# EAGLE schematic PDU_v2 (EAGLE 9.6.2)

## Sheet 1 of 10: PC104 Header
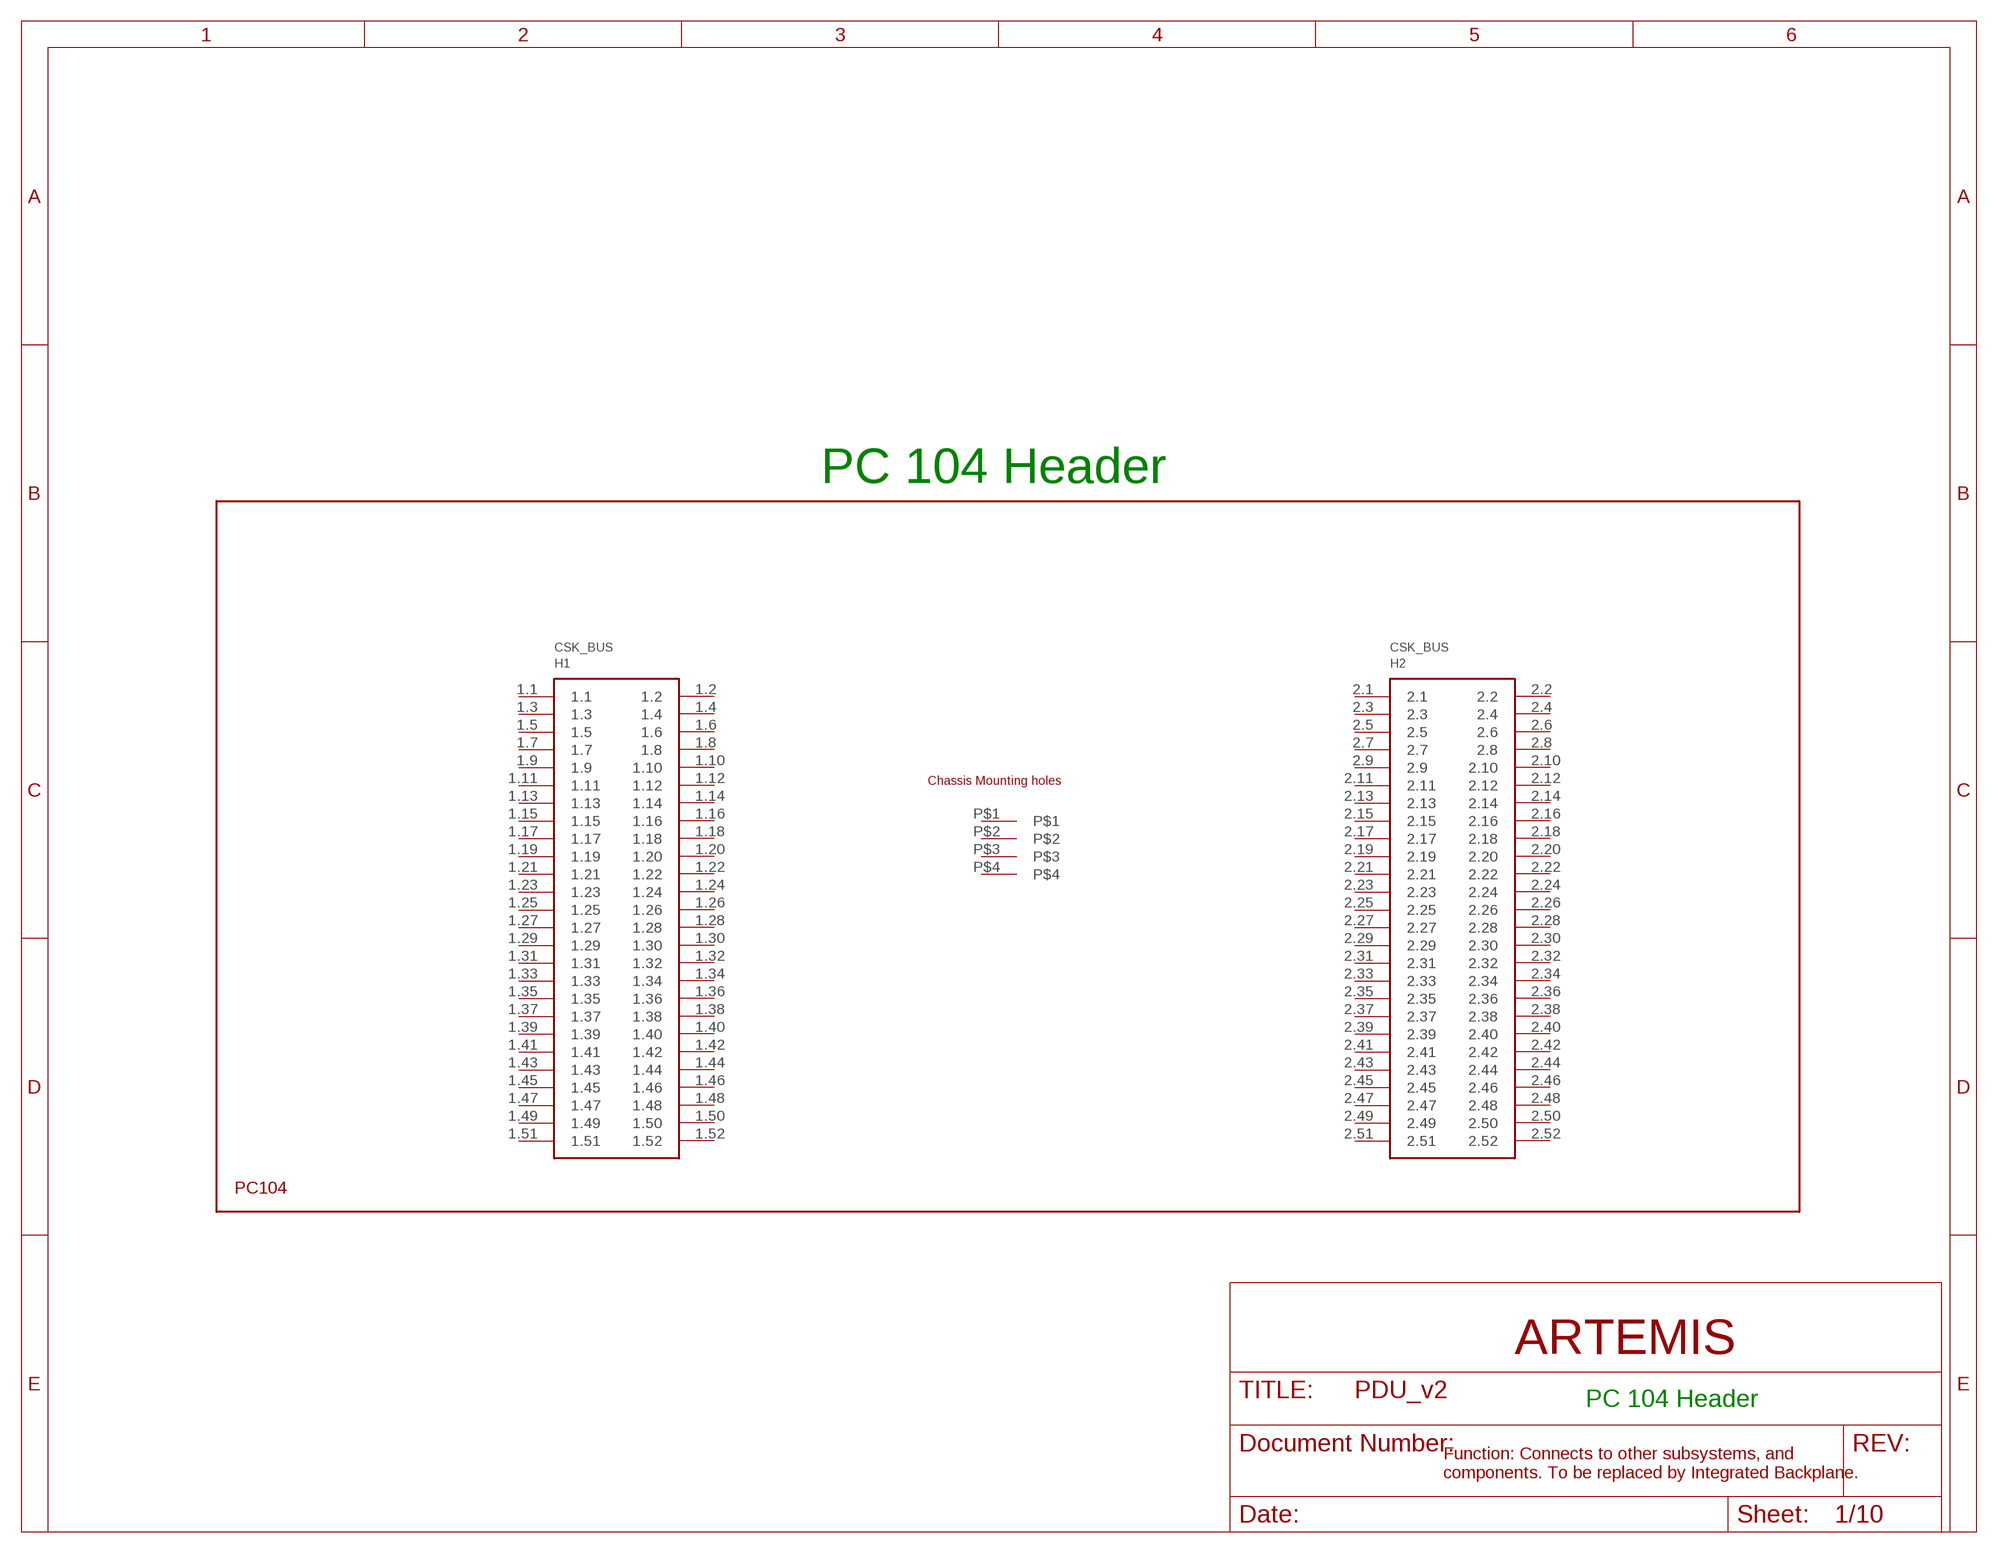
[diagram p0: schematic, sheet 1]

### Parts
H1  PC104_WCONN  [PC104_WCONN]
Unconnected: H1.1.1 H1.1.2 H1.1.3 H1.1.4 H1.1.5 H1.1.6 H1.1.7 H1.1.8 H1.1.9 H1.1.10 H1.1.11 H1.1.12 H1.1.13 H1.1.14 H1.1.15 H1.1.16 H1.1.17 H1.1.18 H1.1.19 H1.1.20 H1.1.21 H1.1.22 H1.1.23 H1.1.24 H1.1.25 H1.1.26 H1.1.27 H1.1.28 H1.1.29 H1.1.30 H1.1.31 H1.1.32 H1.1.33 H1.1.34 H1.1.35 H1.1.36 H1.1.37 H1.1.38 H1.1.39 H1.1.40 H1.1.41 H1.1.42 H1.1.43 H1.1.44 H1.1.45 H1.1.46 H1.1.47 H1.1.48 H1.1.49 H1.1.50 H1.1.51 H1.1.52 H1.2.1 H1.2.2 H1.2.3 H1.2.4 H1.2.5 H1.2.6 H1.2.7 H1.2.8 H1.2.9 H1.2.10 H1.2.11 H1.2.12 H1.2.13 H1.2.14 H1.2.15 H1.2.16 H1.2.17 H1.2.18 H1.2.19 H1.2.20 H1.2.21 H1.2.22 H1.2.23 H1.2.24 H1.2.25 H1.2.26 H1.2.27 H1.2.28 H1.2.29 H1.2.30 H1.2.31 H1.2.32 H1.2.33 H1.2.34 H1.2.35 H1.2.36 H1.2.37 H1.2.38 H1.2.39 H1.2.40 H1.2.41 H1.2.42 H1.2.43 H1.2.44 H1.2.45 H1.2.46 H1.2.47 H1.2.48 H1.2.49 H1.2.50 H1.2.51 H1.2.52 H1.P$1 H1.P$2 H1.P$3 H1.P$4

### Notes on the sheet
- PC 104 Header
- ARTEMIS
- PC 104 Header
- Function: Connects to other subsystems, and 
  components. To be replaced by Integrated Backplane.

## Sheet 2 of 10: Connectors
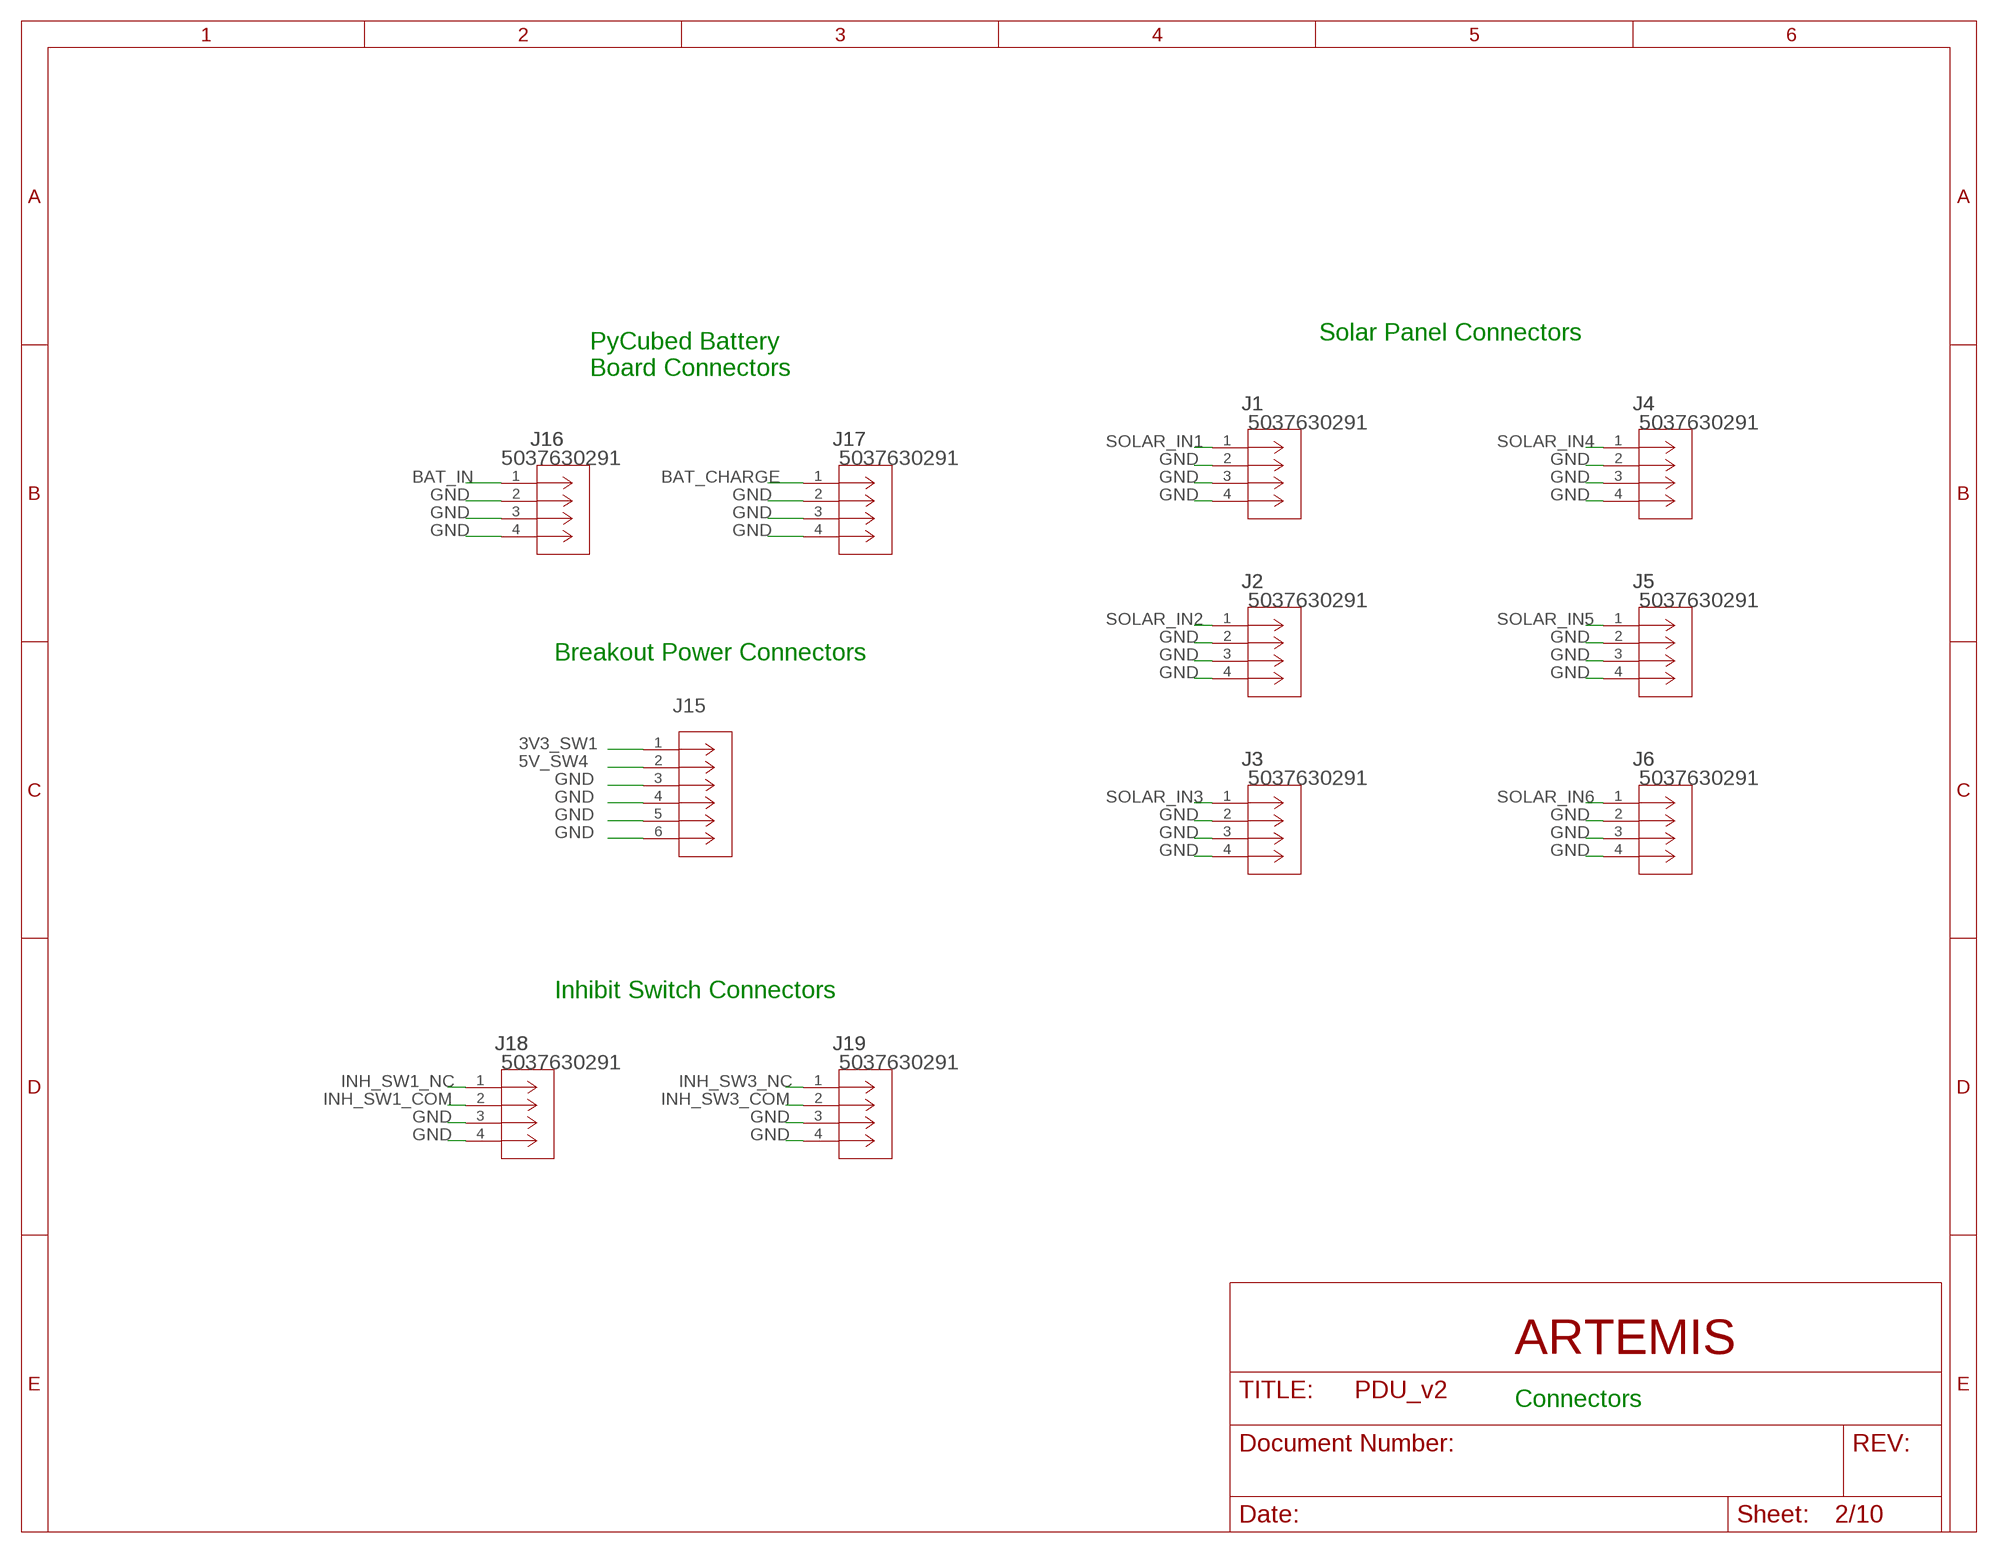
[diagram p1: schematic, sheet 2]

### Parts
J1  5037630291  [CON_5037630291]
J2  5037630291  [CON_5037630291]
J3  5037630291  [CON_5037630291]
J4  5037630291  [CON_5037630291]
J5  5037630291  [CON_5037630291]
J6  5037630291  [CON_5037630291]
J15  5037630491  [CON_5037630491]
J16  5037630291  [CON_5037630291]
J17  5037630291  [CON_5037630291]
J18  5037630291  [CON_5037630291]
J19  5037630291  [CON_5037630291]

### Nets
3V3_SW1: J15.1
5V_SW4: J15.2
BAT_CHARGE: J17.1
BAT_IN: J16.1
GND: J1.2 J1.3 J1.4 J2.2 J2.3 J2.4 J3.2 J3.3 J3.4 J4.2 J4.3 J4.4 J5.2 J5.3 J5.4 J6.2 J6.3 J6.4 J15.3 J15.4 J15.5 J15.6 J16.2 J16.3 J16.4 J17.2 J17.3 J17.4 J18.3 J18.4 J19.3 J19.4 ; also sheet 3,4,5,6,7,8,9
INH_SW1_COM: J18.2
INH_SW1_NC: J18.1
INH_SW3_COM: J19.2
INH_SW3_NC: J19.1
SOLAR_IN1: J1.1 ; also sheet 7
SOLAR_IN2: J2.1 ; also sheet 7
SOLAR_IN3: J3.1 ; also sheet 7
SOLAR_IN4: J4.1 ; also sheet 7
SOLAR_IN5: J5.1 ; also sheet 7
SOLAR_IN6: J6.1 ; also sheet 7

### Notes on the sheet
- Solar Panel Connectors
- PyCubed Battery 
  Board Connectors
- Breakout Power Connectors
- Inhibit Switch Connectors
- ARTEMIS
- Connectors

## Sheet 3 of 10: H-Bridge Circuits
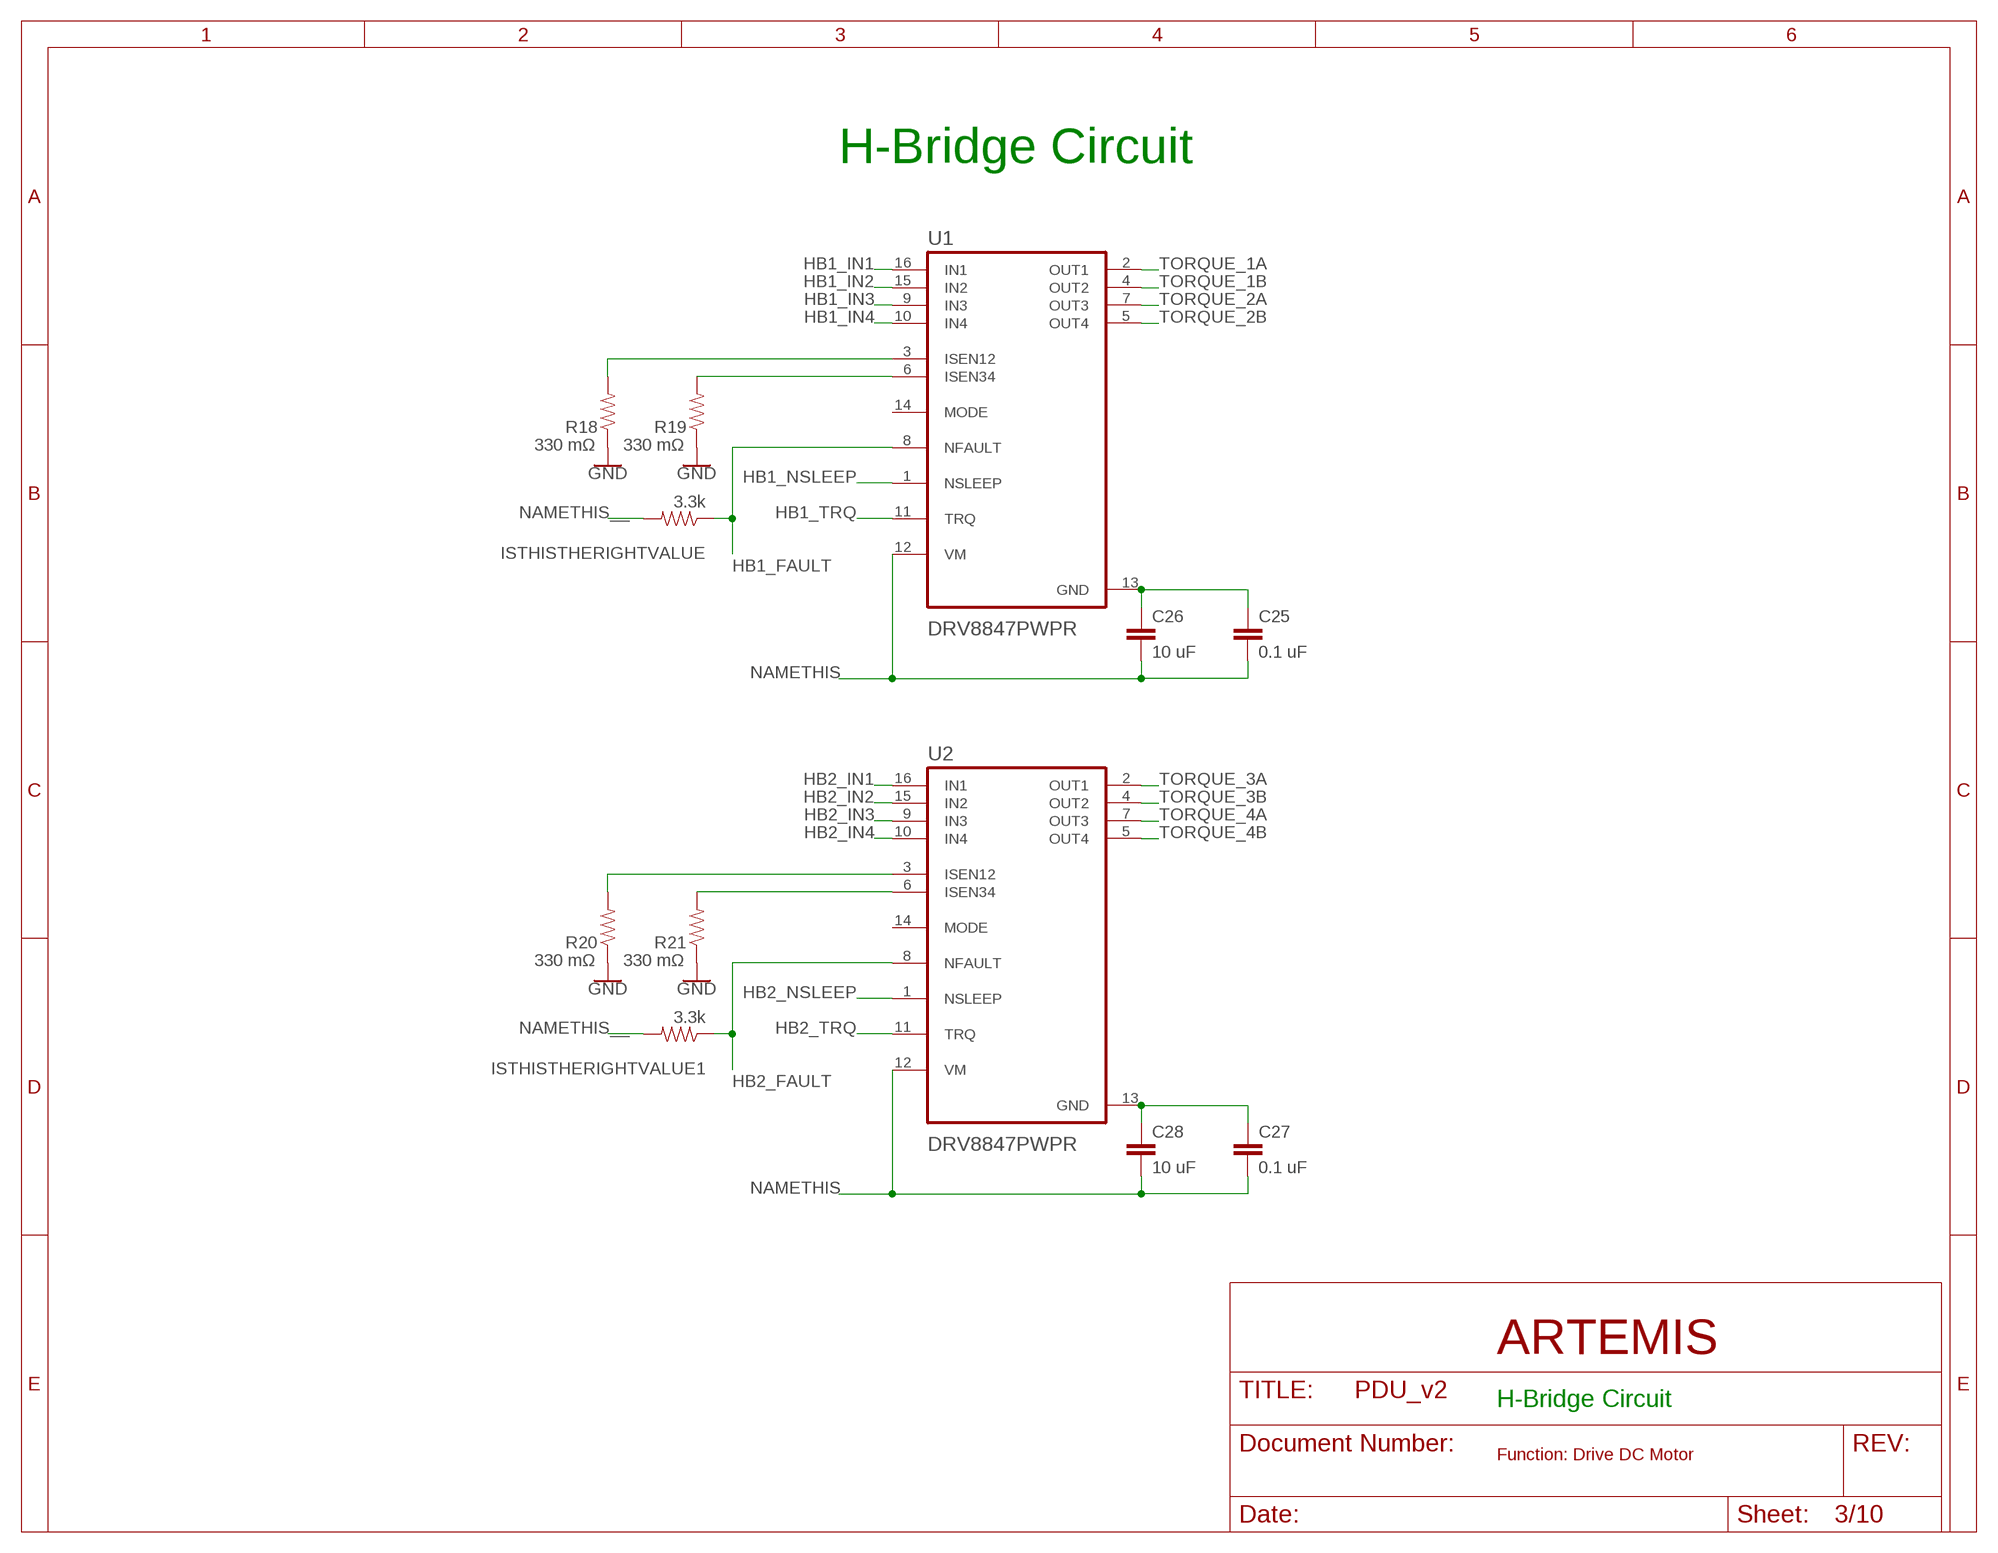
[diagram p2: schematic, sheet 3]

### Parts
C25  0.1 uF  CAP0805  [0805]
C26  10 uF  CAP0805  [0805]
C27  0.1 uF  CAP0805  [0805]
C28  10 uF  CAP0805  [0805]
ISTHISTHERIGHTVALUE  3.3k  RESISTOR0805-RES  [0805]
ISTHISTHERIGHTVALUE1  3.3k  RESISTOR0805-RES  [0805]
R18  330 mΩ  RESISTOR0805-RES  [0805]
R19  330 mΩ  RESISTOR0805-RES  [0805]
R20  330 mΩ  RESISTOR0805-RES  [0805]
R21  330 mΩ  RESISTOR0805-RES  [0805]
U1  DRV8847PWPR  [SOP65P640X120-17N]
U2  DRV8847PWPR  [SOP65P640X120-17N]

### Nets
GND: R18.1 R19.1 R20.1 R21.1 ; also sheet 2,4,5,6,7,8,9
HB1_FAULT: ISTHISTHERIGHTVALUE.1 U1.8(NFAULT)
HB1_IN1: U1.16(IN1)
HB1_IN2: U1.15(IN2)
HB1_IN3: U1.9(IN3)
HB1_IN4: U1.10(IN4)
HB1_NSLEEP: U1.1(NSLEEP)
HB1_TRQ: U1.11(TRQ)
HB2_FAULT: ISTHISTHERIGHTVALUE1.1 U2.8(NFAULT)
HB2_IN1: U2.16(IN1)
HB2_IN2: U2.15(IN2)
HB2_IN3: U2.9(IN3)
HB2_IN4: U2.10(IN4)
HB2_NSLEEP: U2.1(NSLEEP)
HB2_TRQ: U2.11(TRQ)
N$19: C27.1 C28.1 U2.13(GND)
N$20: C25.1 C26.1 U1.13(GND)
N$21: R19.2 U1.6(ISEN34)
N$22: R18.2 U1.3(ISEN12)
N$23: R21.2 U2.6(ISEN34)
N$24: R20.2 U2.3(ISEN12)
NAMETHIS: C25.2 C26.2 C27.2 C28.2 U1.12(VM) U2.12(VM)
NAMETHIS__: ISTHISTHERIGHTVALUE1.2 ISTHISTHERIGHTVALUE.2
TORQUE_1A: U1.2(OUT1)
TORQUE_1B: U1.4(OUT2)
TORQUE_2A: U1.7(OUT3)
TORQUE_2B: U1.5(OUT4)
TORQUE_3A: U2.2(OUT1)
TORQUE_3B: U2.4(OUT2)
TORQUE_4A: U2.7(OUT3)
TORQUE_4B: U2.5(OUT4)
Unconnected: U1.14(MODE) U2.14(MODE)

### Notes on the sheet
- H-Bridge Circuit
- ARTEMIS
- H-Bridge Circuit
- Function: Drive DC Motor

## Sheet 4 of 10: Switch Regulator (3V3, 5V, VBattery)
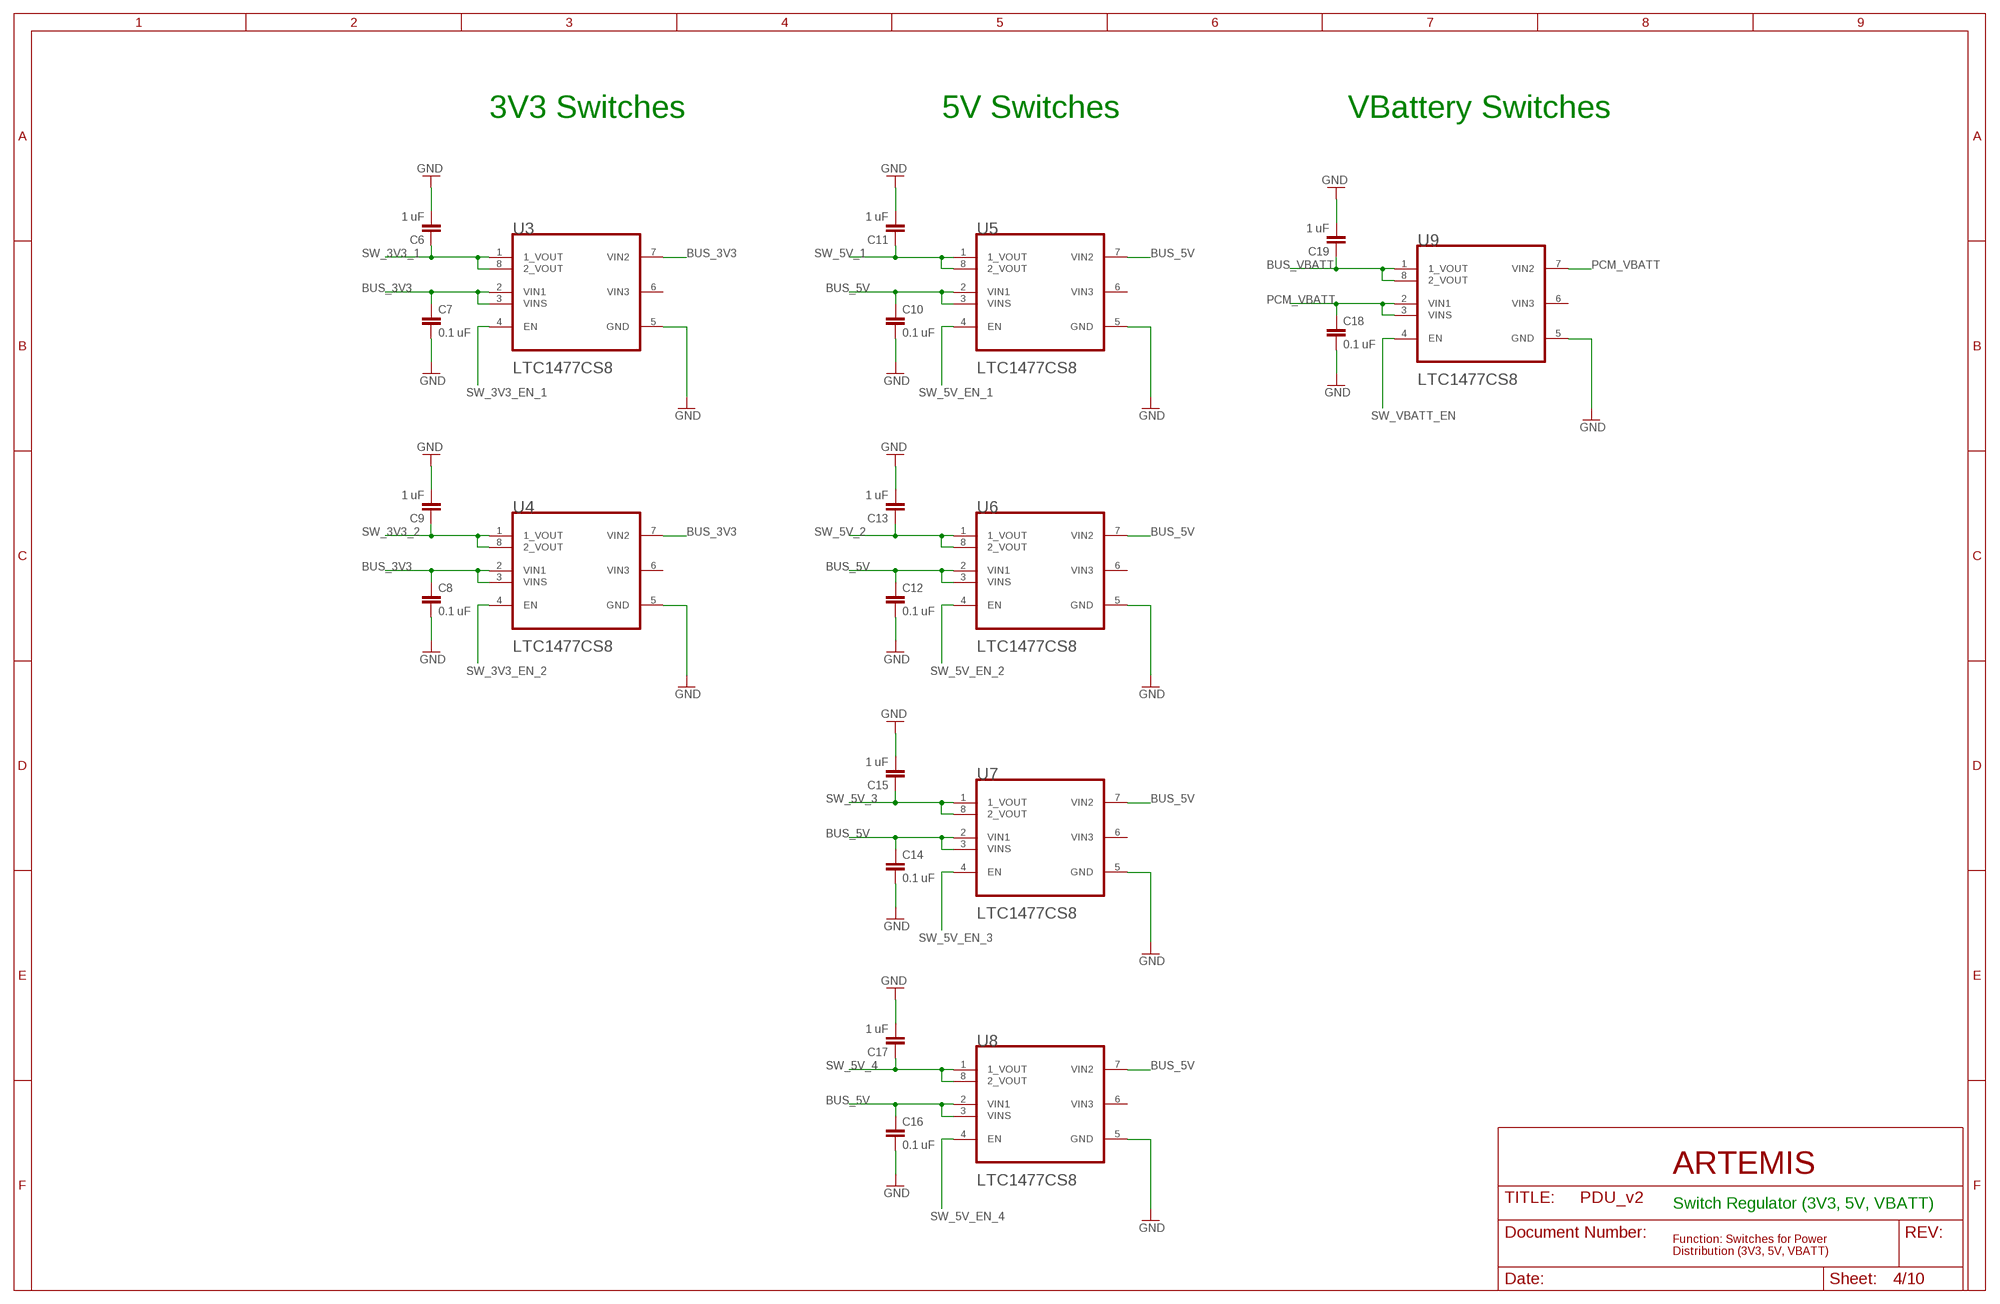
[diagram p3: schematic, sheet 4]

### Parts
C6  1 uF  CAP0805  [0805]
C7  0.1 uF  CAP0805  [0805]
C8  0.1 uF  CAP0805  [0805]
C9  1 uF  CAP0805  [0805]
C10  0.1 uF  CAP0805  [0805]
C11  1 uF  CAP0805  [0805]
C12  0.1 uF  CAP0805  [0805]
C13  1 uF  CAP0805  [0805]
C14  0.1 uF  CAP0805  [0805]
C15  1 uF  CAP0805  [0805]
C16  0.1 uF  CAP0805  [0805]
C17  1 uF  CAP0805  [0805]
C18  0.1 uF  CAP0805  [0805]
C19  1 uF  CAP0805  [0805]
U3  LTC1477CS8LINEAR_TECHNOLOGY_LTC1477CS8_0_2  [LINEAR_TECHNOLOGY_LTC1477CS8_2]
U4  LTC1477CS8LINEAR_TECHNOLOGY_LTC1477CS8_0_2  [LINEAR_TECHNOLOGY_LTC1477CS8_2]
U5  LTC1477CS8LINEAR_TECHNOLOGY_LTC1477CS8_0_2  [LINEAR_TECHNOLOGY_LTC1477CS8_2]
U6  LTC1477CS8LINEAR_TECHNOLOGY_LTC1477CS8_0_2  [LINEAR_TECHNOLOGY_LTC1477CS8_2]
U7  LTC1477CS8LINEAR_TECHNOLOGY_LTC1477CS8_0_2  [LINEAR_TECHNOLOGY_LTC1477CS8_2]
U8  LTC1477CS8LINEAR_TECHNOLOGY_LTC1477CS8_0_2  [LINEAR_TECHNOLOGY_LTC1477CS8_2]
U9  LTC1477CS8LINEAR_TECHNOLOGY_LTC1477CS8_0_2  [LINEAR_TECHNOLOGY_LTC1477CS8_2]

### Nets
BUS_3V3: C7.1 C8.1 U3.2(VIN1) U3.3(VINS) U3.7(VIN2) U4.2(VIN1) U4.3(VINS) U4.7(VIN2) ; also sheet 6
BUS_5V: C10.1 C12.1 C14.1 C16.1 U5.2(VIN1) U5.3(VINS) U5.7(VIN2) U6.2(VIN1) U6.3(VINS) U6.7(VIN2) U7.2(VIN1) U7.3(VINS) U7.7(VIN2) U8.2(VIN1) U8.3(VINS) U8.7(VIN2) ; also sheet 6
BUS_VBATT: C19.1 U9.1(1_VOUT) U9.8(2_VOUT)
GND: C6.2 C7.2 C8.2 C9.2 C10.2 C11.2 C12.2 C13.2 C14.2 C15.2 C16.2 C17.2 C18.2 C19.2 U3.5(GND) U4.5(GND) U5.5(GND) U6.5(GND) U7.5(GND) U8.5(GND) U9.5(GND) ; also sheet 2,3,5,6,7,8,9
PCM_VBATT: C18.1 U9.2(VIN1) U9.3(VINS) U9.7(VIN2) ; also sheet 6,7
SW_3V3_1: C6.1 U3.1(1_VOUT) U3.8(2_VOUT)
SW_3V3_2: C9.1 U4.1(1_VOUT) U4.8(2_VOUT)
SW_3V3_EN_1: U3.4(EN)
SW_3V3_EN_2: U4.4(EN)
SW_5V_1: C11.1 U5.1(1_VOUT) U5.8(2_VOUT)
SW_5V_2: C13.1 U6.1(1_VOUT) U6.8(2_VOUT)
SW_5V_3: C15.1 U7.1(1_VOUT) U7.8(2_VOUT)
SW_5V_4: C17.1 U8.1(1_VOUT) U8.8(2_VOUT)
SW_5V_EN_1: U5.4(EN)
SW_5V_EN_2: U6.4(EN)
SW_5V_EN_3: U7.4(EN)
SW_5V_EN_4: U8.4(EN)
SW_VBATT_EN: U9.4(EN)

### Notes on the sheet
- 3V3 Switches | 5V Switches | VBattery Switches
- ARTEMIS
- Switch Regulator (3V3, 5V, VBATT) | Switches (3V3, 5V, VBATT)
- Function: Switches for Power 
  Distribution (3V3, 5V, VBATT)

## Sheet 5 of 10: Switch Regulator (12V)
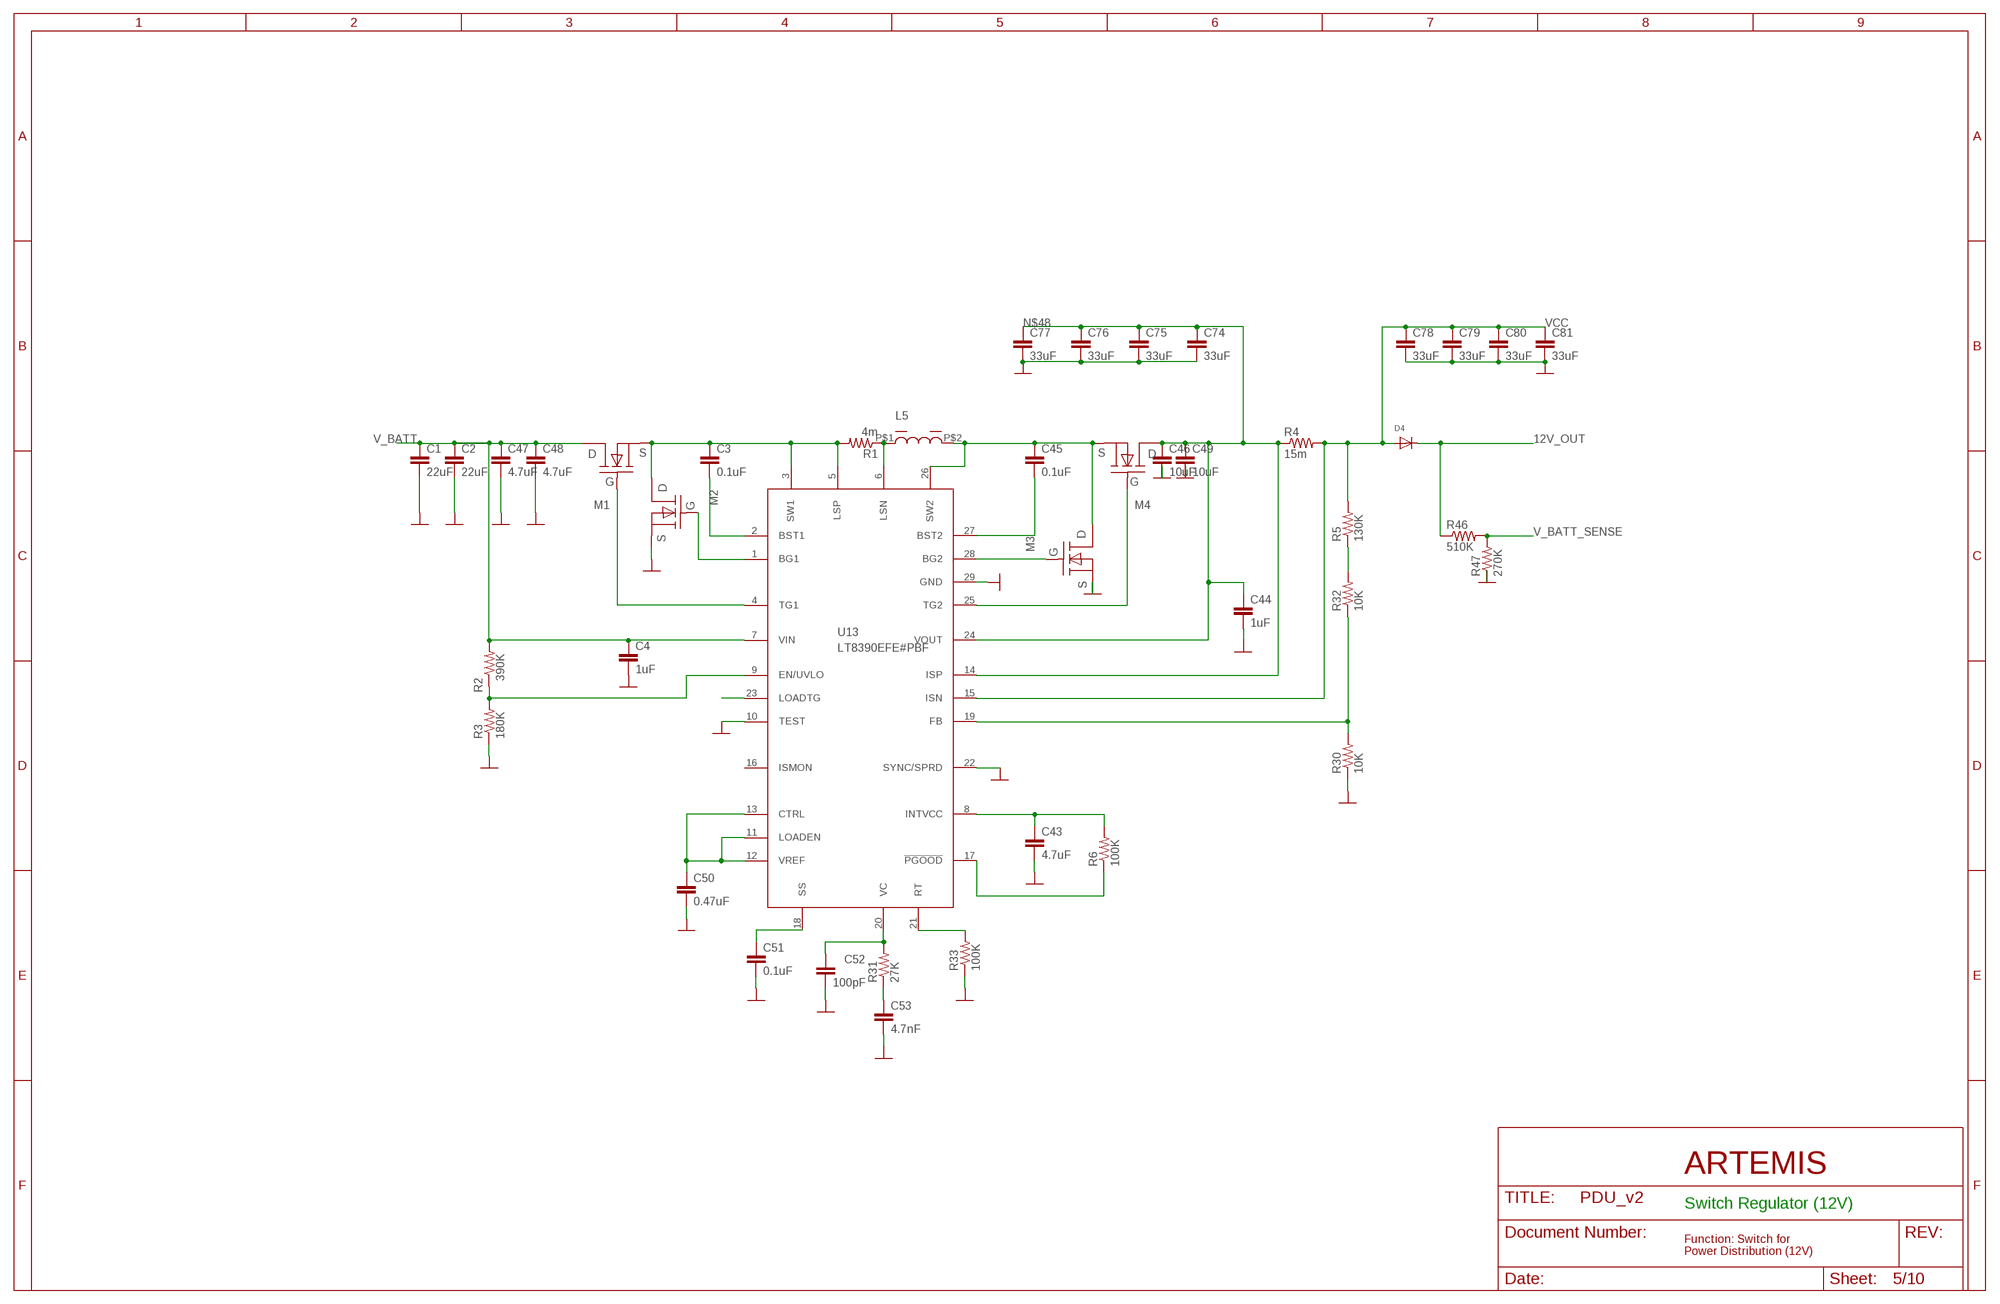
[diagram p4: schematic, sheet 5]

### Parts
C1  22uF  CAP0805  [0805]
C2  22uF  CAP0805  [0805]
C3  0.1uF  CAP0805  [0805]
C4  1uF  CAP0805  [0805]
C43  4.7uF  CAP0805  [0805]
C44  1uF  CAP0805  [0805]
C45  0.1uF  CAP0805  [0805]
C46  10uF  CAP0805  [0805]
C47  4.7uF  CAP0805  [0805]
C48  4.7uF  CAP0805  [0805]
C49  10uF  CAP0805  [0805]
C50  0.47uF  CAP0805  [0805]
C51  0.1uF  CAP0805  [0805]
C52  100pF  CAP0805  [0805]
C53  4.7nF  CAP0805  [0805]
C74  33uF  CAP1206  [1206]
C75  33uF  CAP1206  [1206]
C76  33uF  CAP1206  [1206]
C77  33uF  CAP1206  [1206]
C78  33uF  CAP1206  [1206]
C79  33uF  CAP1206  [1206]
C80  33uF  CAP1206  [1206]
C81  33uF  CAP1206  [1206]
D4  DIODE_SOD-123FL  [SOD-123FL]
L5  6uH  7443551600  [7443551600]
M1  BSZ100N06LS3  [BSZ100N06LS3]
M2  BSZ100N06LS3  [BSZ100N06LS3]
M3  BSZ033NE2LS5  BSZ100N06LS3  [BSZ100N06LS3]
M4  BSZ033NE2LS5  BSZ100N06LS3  [BSZ100N06LS3]
R1  4m  RESISTOR0805-RES  [0805]
R2  390K  RESISTOR0805-RES  [0805]
R3  180K  RESISTOR0805-RES  [0805]
R4  15m  RESISTOR0805-RES  [0805]
R5  130K  RESISTOR0805-RES  [0805]
R6  100K  RESISTOR0805-RES  [0805]
R30  10K  RESISTOR0805-RES  [0805]
R31  27K  RESISTOR0805-RES  [0805]
R32  10K  RESISTOR0805-RES  [0805]
R33  100K  RESISTOR0805-RES  [0805]
R46  510K  RESISTOR0805-RES  [0805]
R47  270K  RESISTOR0805-RES  [0805]
U13  LT8390EFE#PBF  [SOP65P640X120-29N]

### Nets
12V_OUT: D4.C R46.1
GND: C1.2 C2.2 C4.2 C43.2 C44.2 C46.2 C47.2 C48.2 C49.2 C50.2 C51.2 C52.2 C53.2 C74.2 C75.2 C76.2 C77.2 C78.2 C79.2 C80.2 C81.2 M2.P$2(S) M2.P$3(S) M2.P$4(S) M3.P$2(S) M3.P$3(S) M3.P$4(S) R3.1 R30.1 R33.1 R47.1 U13.10(TEST) U13.22(SYNC/SPRD) U13.29(GND) ; also sheet 2,3,4,6,7,8,9
N$1: C3.1 M1.P$2(S) M1.P$3(S) M1.P$4(S) M2.P$5(D) M2.P$6(D) M2.P$7(D) M2.P$8(D) M2.P$9(D) R1.2 U13.3(SW1) U13.5(LSP)
N$2: C3.2 U13.2(BST1)
N$3: M2.P$1(G) U13.1(BG1)
N$4: M1.P$1(G) U13.4(TG1)
N$5: R2.1 R3.2 U13.9(EN/UVLO)
N$6: M3.P$1(G) U13.28(BG2)
N$38: C52.1 R31.2 U13.20(VC)
N$39: C50.1 U13.11(LOADEN) U13.12(VREF) U13.13(CTRL)
N$40: R5.1 R32.2
N$41: C45.1 L5.P$2 M3.P$5(D) M3.P$6(D) M3.P$7(D) M3.P$8(D) M3.P$9(D) M4.P$2(S) M4.P$3(S) M4.P$4(S) U13.26(SW2)
N$42: U13.23(LOADTG)
N$43: R6.1 U13.17(!PGOOD)
N$44: C43.1 R6.2 U13.8(INTVCC)
N$45: L5.P$1 R1.1 U13.6(LSN)
N$47: C45.2 U13.27(BST2)
N$48: C44.1 C46.1 C49.1 C74.1 C75.1 C76.1 C77.1 M4.P$5(D) M4.P$6(D) M4.P$7(D) M4.P$8(D) M4.P$9(D) R4.1 U13.14(ISP) U13.24(VOUT)
N$49: M4.P$1(G) U13.25(TG2)
N$50: C51.1 U13.18(SS)
N$51: R30.2 R32.1 U13.19(FB)
N$52: R33.2 U13.21(RT)
N$55: C53.1 R31.1
V_BATT: C1.1 C2.1 C4.1 C47.1 C48.1 M1.P$5(D) M1.P$6(D) M1.P$7(D) M1.P$8(D) M1.P$9(D) R2.2 U13.7(VIN)
V_BATT_SENSE: R46.2 R47.2
VCC: C78.1 C79.1 C80.1 C81.1 D4.A R4.2 R5.2 U13.15(ISN) ; also sheet 9
Unconnected: U13.16(ISMON)

### Notes on the sheet
- ARTEMIS
- Switch Regulator (12V)
- Function: Switch for 
  Power Distribution (12V)

## Sheet 6 of 10: Bus (3V3, 5V)
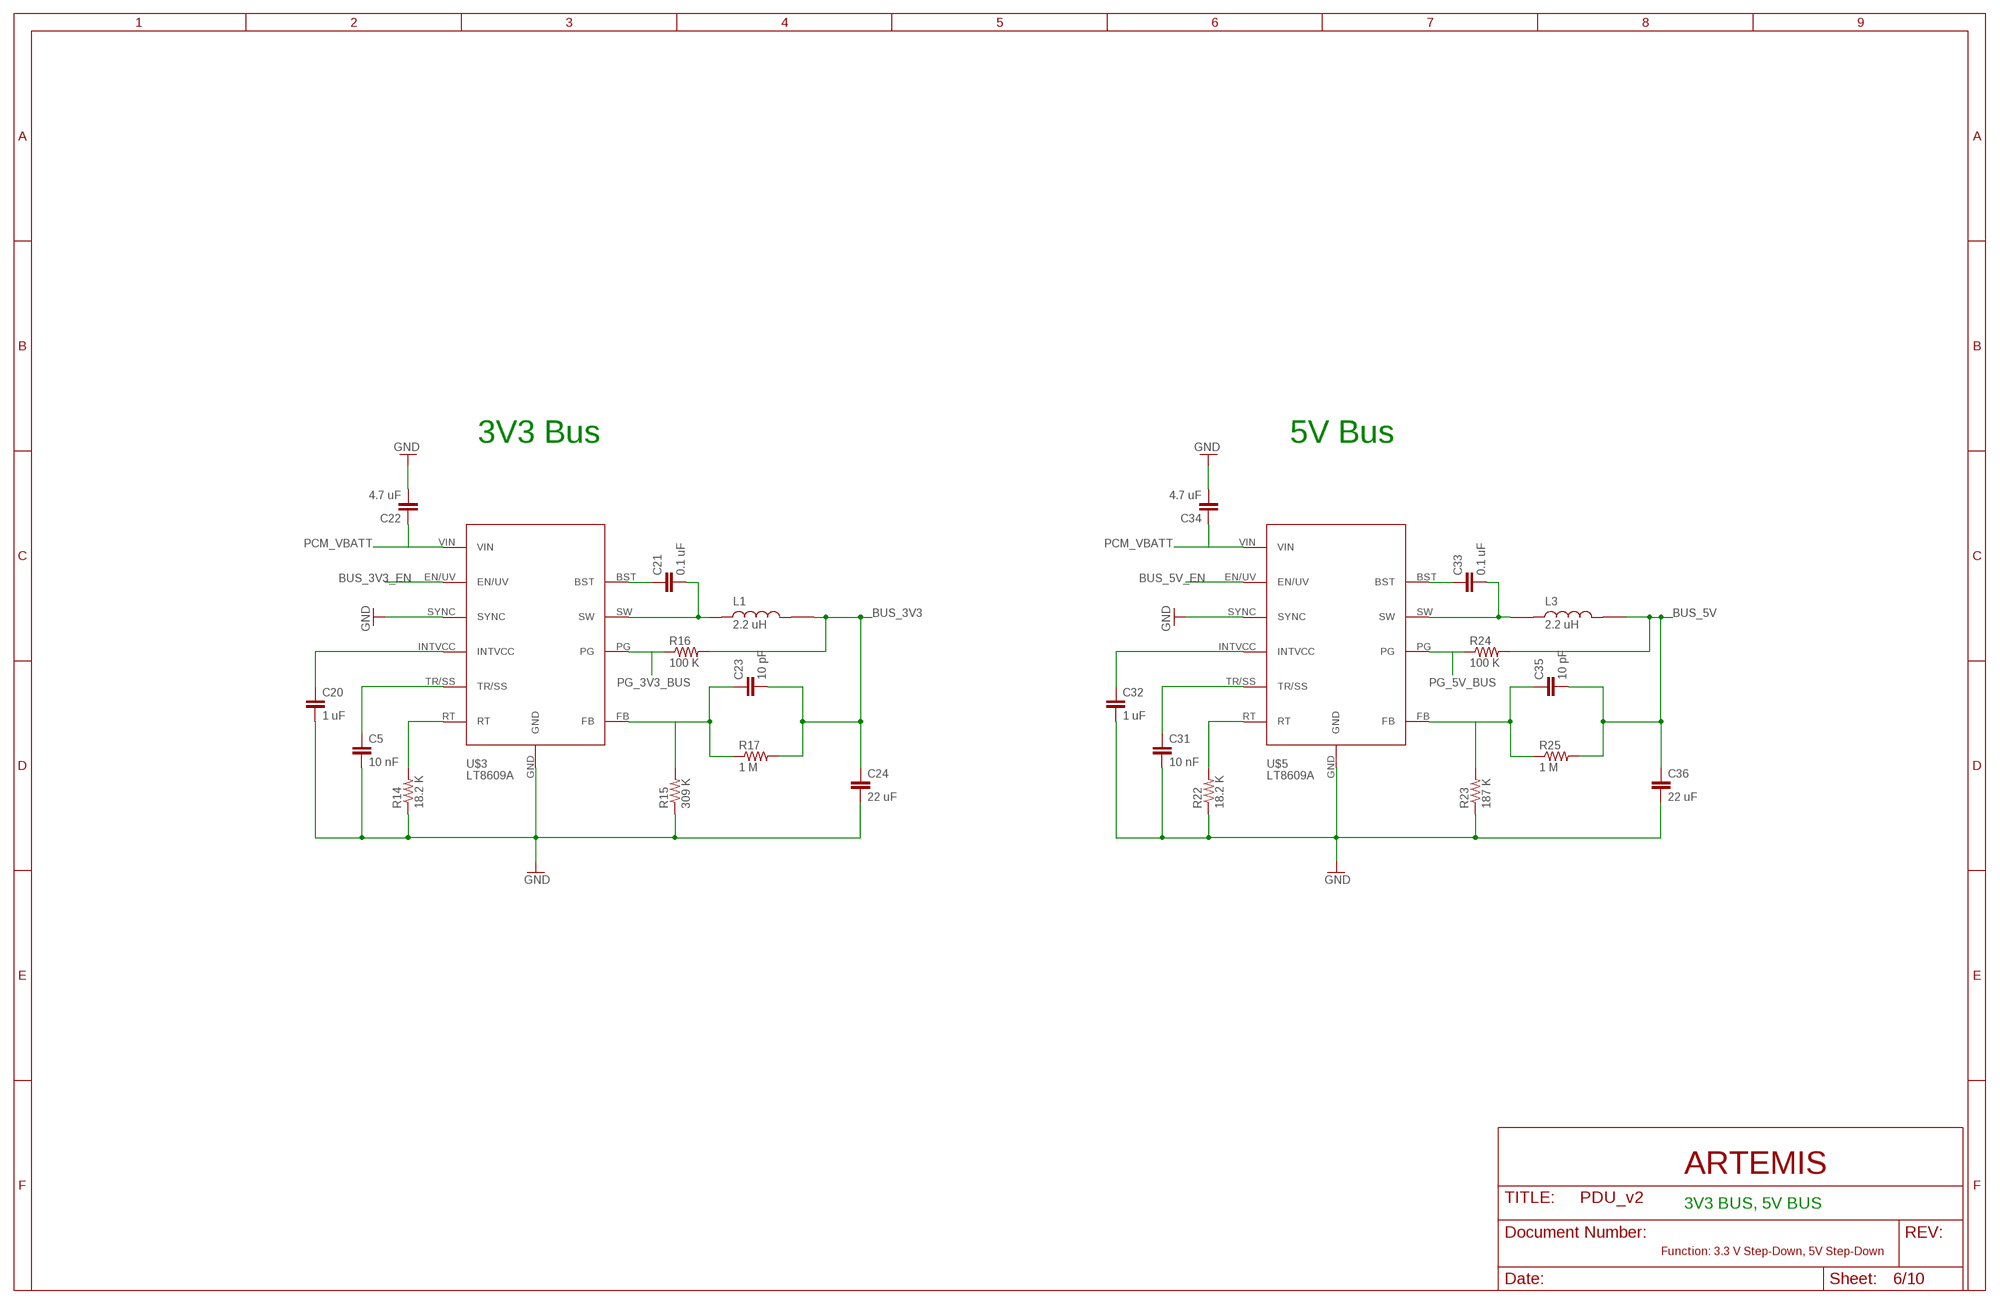
[diagram p5: schematic, sheet 6]

### Parts
C5  10 nF  CAP0805  [0805]
C20  1 uF  CAP0805  [0805]
C21  0.1 uF  CAP0805  [0805]
C22  4.7 uF  CAP0805  [0805]
C23  10 pF  CAP0805  [0805]
C24  22 uF  CAP1206  [1206]
C31  10 nF  CAP0805  [0805]
C32  1 uF  CAP0805  [0805]
C33  0.1 uF  CAP0805  [0805]
C34  4.7 uF  CAP0805  [0805]
C35  10 pF  CAP0805  [0805]
C36  22 uF  CAP1206  [1206]
L1  2.2 uH  XFL4020-222ME  [IND_XFL4020-222ME]
L3  2.2 uH  XFL4020-222ME  [IND_XFL4020-222ME]
R14  18.2 K  RESISTOR0805-RES  [0805]
R15  309 K  RESISTOR0805-RES  [0805]
R16  100 K  RESISTOR0805-RES  [0805]
R17  1 M  RESISTOR0805-RES  [0805]
R22  18.2 K  RESISTOR0805-RES  [0805]
R23  187 K  RESISTOR0805-RES  [0805]
R24  100 K  RESISTOR0805-RES  [0805]
R25  1 M  RESISTOR0805-RES  [0805]
U$3  LT8609A  [MSOP_10PAD]
U$5  LT8609A  [MSOP_10PAD]

### Nets
BUS_3V3: C23.2 C24.1 L1.2 R16.2 R17.2 ; also sheet 4
BUS_3V3_EN: U$3.EN/UV
BUS_5V: C35.2 C36.1 L3.2 R24.2 R25.2 ; also sheet 4
BUS_5V_EN: U$5.EN/UV
GND: C5.2 C20.2 C22.2 C24.2 C31.2 C32.2 C34.2 C36.2 R14.1 R15.1 R22.1 R23.1 U$3.GND U$3.SYNC U$5.GND U$5.SYNC ; also sheet 2,3,4,5,7,8,9
N$7: C20.1 U$3.INTVCC
N$8: R14.2 U$3.RT
N$9: C23.1 R15.2 R17.1 U$3.FB
N$10: C5.1 U$3.TR/SS
N$11: C21.1 U$3.BST
N$12: C21.2 L1.1 U$3.SW
N$25: R22.2 U$5.RT
N$26: C31.1 U$5.TR/SS
N$27: C32.1 U$5.INTVCC
N$28: C33.1 U$5.BST
N$29: C33.2 L3.1 U$5.SW
N$30: C35.1 R23.2 R25.1 U$5.FB
PCM_VBATT: C22.1 C34.1 U$3.VIN U$5.VIN ; also sheet 4,7
PG_3V3_BUS: R16.1 U$3.PG
PG_5V_BUS: R24.1 U$5.PG

### Notes on the sheet
- 3V3 Bus | 5V Bus
- ARTEMIS
- 3V3 BUS, 5V BUS
- Function: 3.3 V Step-Down, 5V Step-Down

## Sheet 7 of 10: 5V Burn
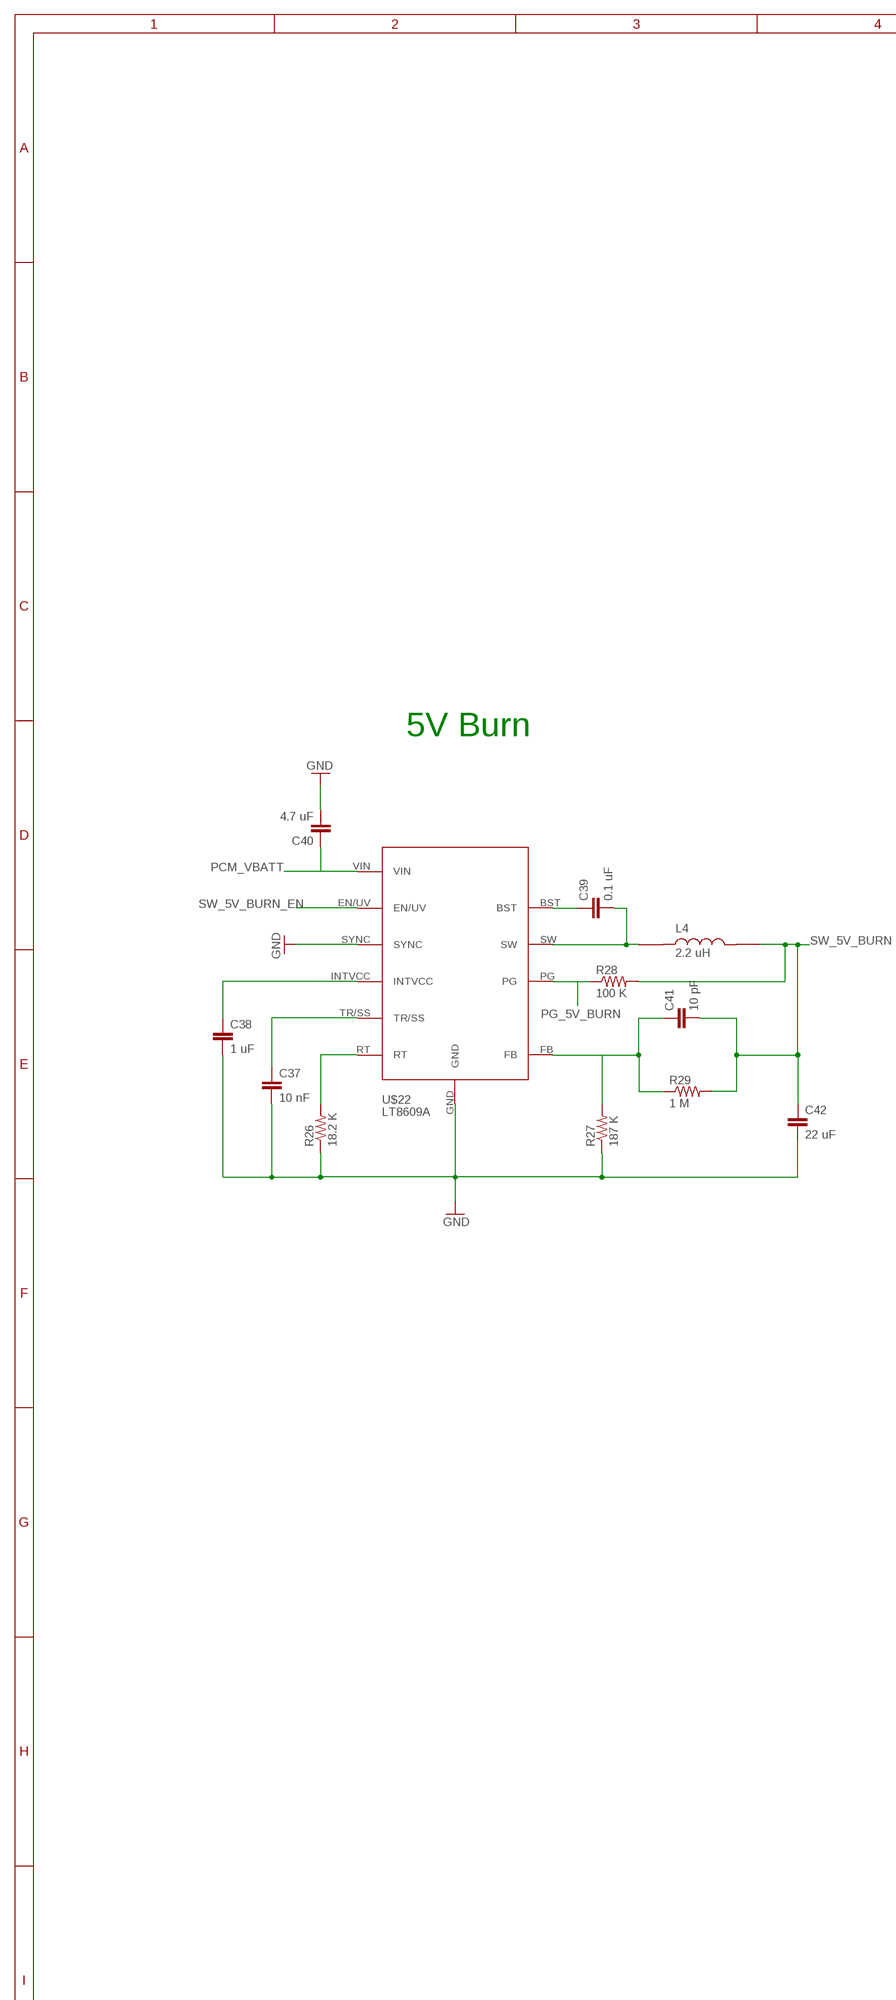
[diagram p6: schematic, sheet 7, part 1 of 2]
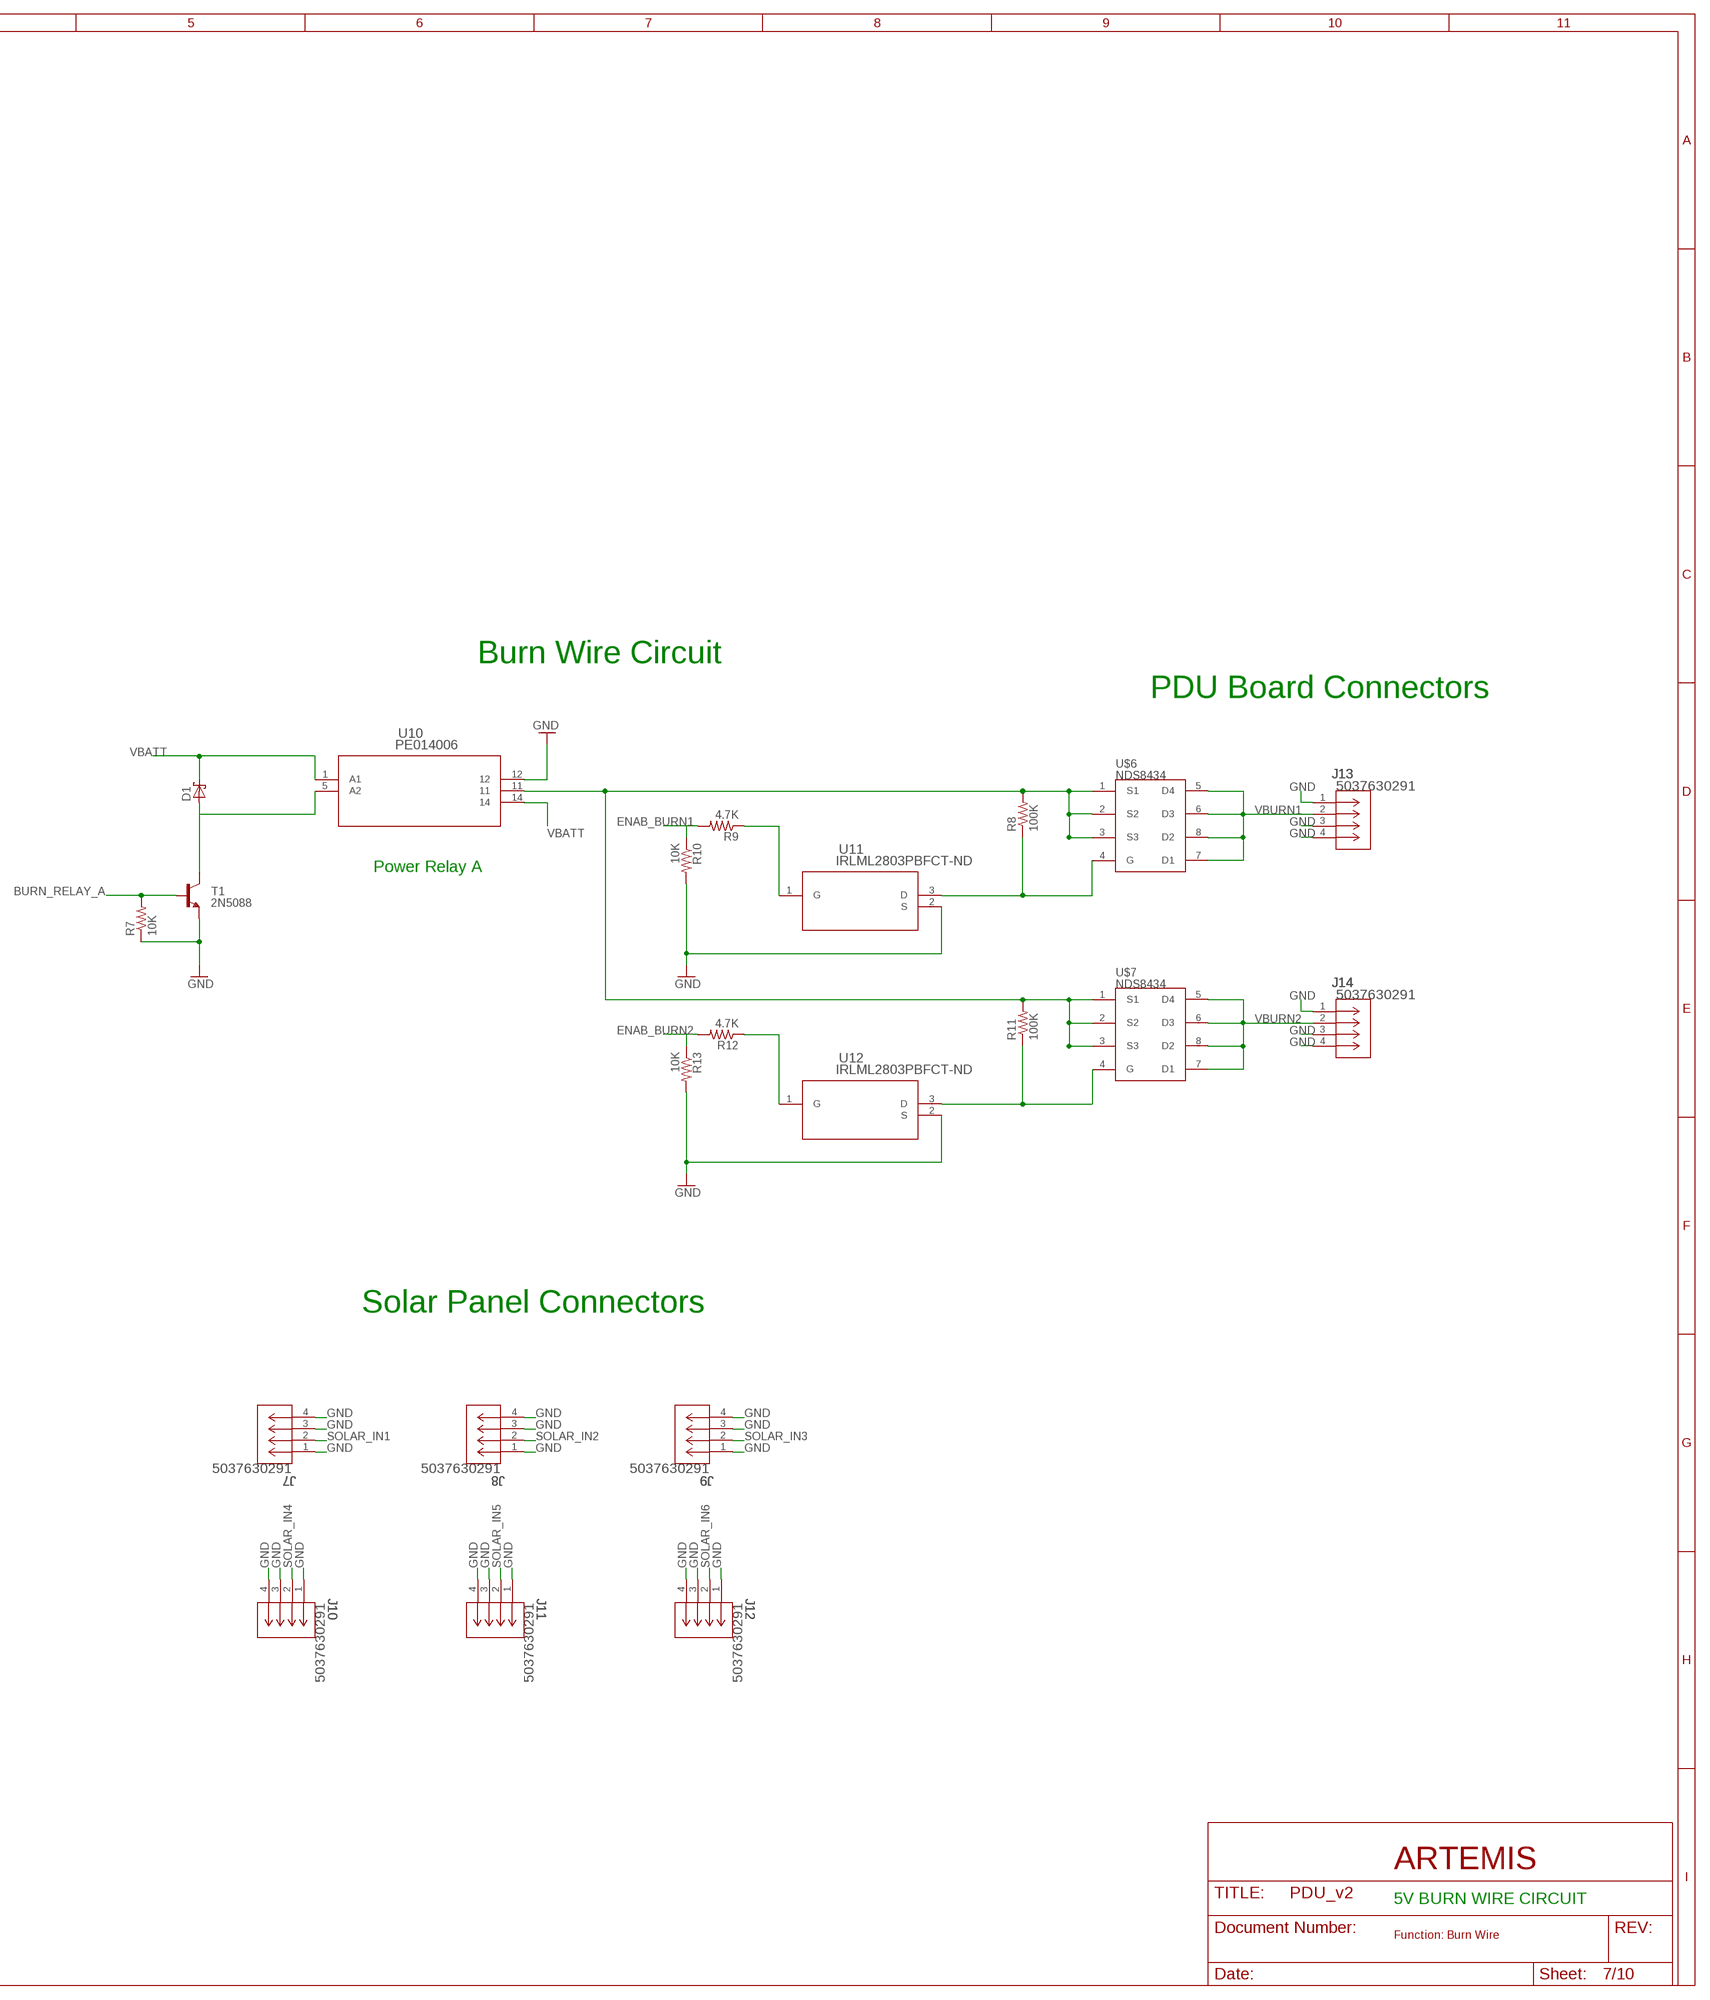
[diagram p7: schematic, sheet 7, part 2 of 2]

### Parts
C37  10 nF  CAP0805  [0805]
C38  1 uF  CAP0805  [0805]
C39  0.1 uF  CAP0805  [0805]
C40  4.7 uF  CAP0805  [0805]
C41  10 pF  CAP0805  [0805]
C42  22 uF  CAP1206  [1206]
D1  SBR2A40P1Q7DFLS130L-7  [POWERDI-123]
J7  5037630291  [CON_5037630291]
J8  5037630291  [CON_5037630291]
J9  5037630291  [CON_5037630291]
J10  5037630291  [CON_5037630291]
J11  5037630291  [CON_5037630291]
J12  5037630291  [CON_5037630291]
J13  5037630291  [CON_5037630291]
J14  5037630291  [CON_5037630291]
L4  2.2 uH  XFL4020-222ME  [IND_XFL4020-222ME]
R7  10K  RESISTOR0603-RES  [0603-RES]
R8  100K  RESISTOR0603-RES  [0603-RES]
R9  4.7K  RESISTOR0603-RES  [0603-RES]
R10  10K  RESISTOR0603-RES  [0603-RES]
R11  100K  RESISTOR0603-RES  [0603-RES]
R12  4.7K  RESISTOR0603-RES  [0603-RES]
R13  10K  RESISTOR0603-RES  [0603-RES]
R26  18.2 K  RESISTOR0805-RES  [0805]
R27  187 K  RESISTOR0805-RES  [0805]
R28  100 K  RESISTOR0805-RES  [0805]
R29  1 M  RESISTOR0805-RES  [0805]
T1  2N5088  [TO92]
U10  PE014006  [RELAY5-PE_CO]
U11  IRLML2803PBFCT-ND  [PG-TO23-3_INF]
U12  IRLML2803PBFCT-ND  [PG-TO23-3_INF]
U$6  NDS8434  [SO08]
U$7  NDS8434  [SO08]
U$22  LT8609A  [MSOP_10PAD]

### Nets
BURN_RELAY_A: R7.2 T1.2(B)
ENAB_BURN1: R9.2 R10.1
ENAB_BURN2: R12.2 R13.1
GND: C37.2 C38.2 C40.2 C42.2 J7.1 J7.3 J7.4 J8.1 J8.3 J8.4 J9.1 J9.3 J9.4 J10.1 J10.3 J10.4 J11.1 J11.3 J11.4 J12.1 J12.3 J12.4 J13.1 J13.3 J13.4 J14.1 J14.3 J14.4 R7.1 R10.2 R13.2 R26.1 R27.1 T1.3(E) U10.12 U11.2(S) U12.2(S) U$22.GND U$22.SYNC ; also sheet 2,3,4,5,6,8,9
N$13: R8.2 R11.2 U10.11 U$6.1(S1) U$6.2(S2) U$6.3(S3) U$7.1(S1) U$7.2(S2) U$7.3(S3)
N$14: R12.1 U12.1(G)
N$15: R11.1 U12.3(D) U$7.4(G)
N$16: D1.A T1.1(C) U10.5(A2)
N$17: R9.1 U11.1(G)
N$18: R8.1 U11.3(D) U$6.4(G)
N$31: R26.2 U$22.RT
N$32: C37.1 U$22.TR/SS
N$33: C38.1 U$22.INTVCC
N$34: C39.1 U$22.BST
N$35: C39.2 L4.1 U$22.SW
N$36: C41.1 R27.2 R29.1 U$22.FB
PCM_VBATT: C40.1 U$22.VIN ; also sheet 4,6
PG_5V_BURN: R28.1 U$22.PG
SOLAR_IN1: J7.2 ; also sheet 2
SOLAR_IN2: J8.2 ; also sheet 2
SOLAR_IN3: J9.2 ; also sheet 2
SOLAR_IN4: J10.2 ; also sheet 2
SOLAR_IN5: J11.2 ; also sheet 2
SOLAR_IN6: J12.2 ; also sheet 2
SW_5V_BURN: C41.2 C42.1 L4.2 R28.2 R29.2
SW_5V_BURN_EN: U$22.EN/UV
VBATT: D1.C U10.1(A1) U10.14 ; also sheet 8
VBURN1: J13.2 U$6.5(D4) U$6.6(D3) U$6.7(D1) U$6.8(D2)
VBURN2: J14.2 U$7.5(D4) U$7.6(D3) U$7.7(D1) U$7.8(D2)

### Notes on the sheet
- Burn Wire Circuit
- 5V Burn | PDU Board Connectors
- Power Relay A
- Solar Panel Connectors
- ARTEMIS
- 5V BURN WIRE CIRCUIT
- Function: Burn Wire

## Sheet 8 of 10: Microprocessor
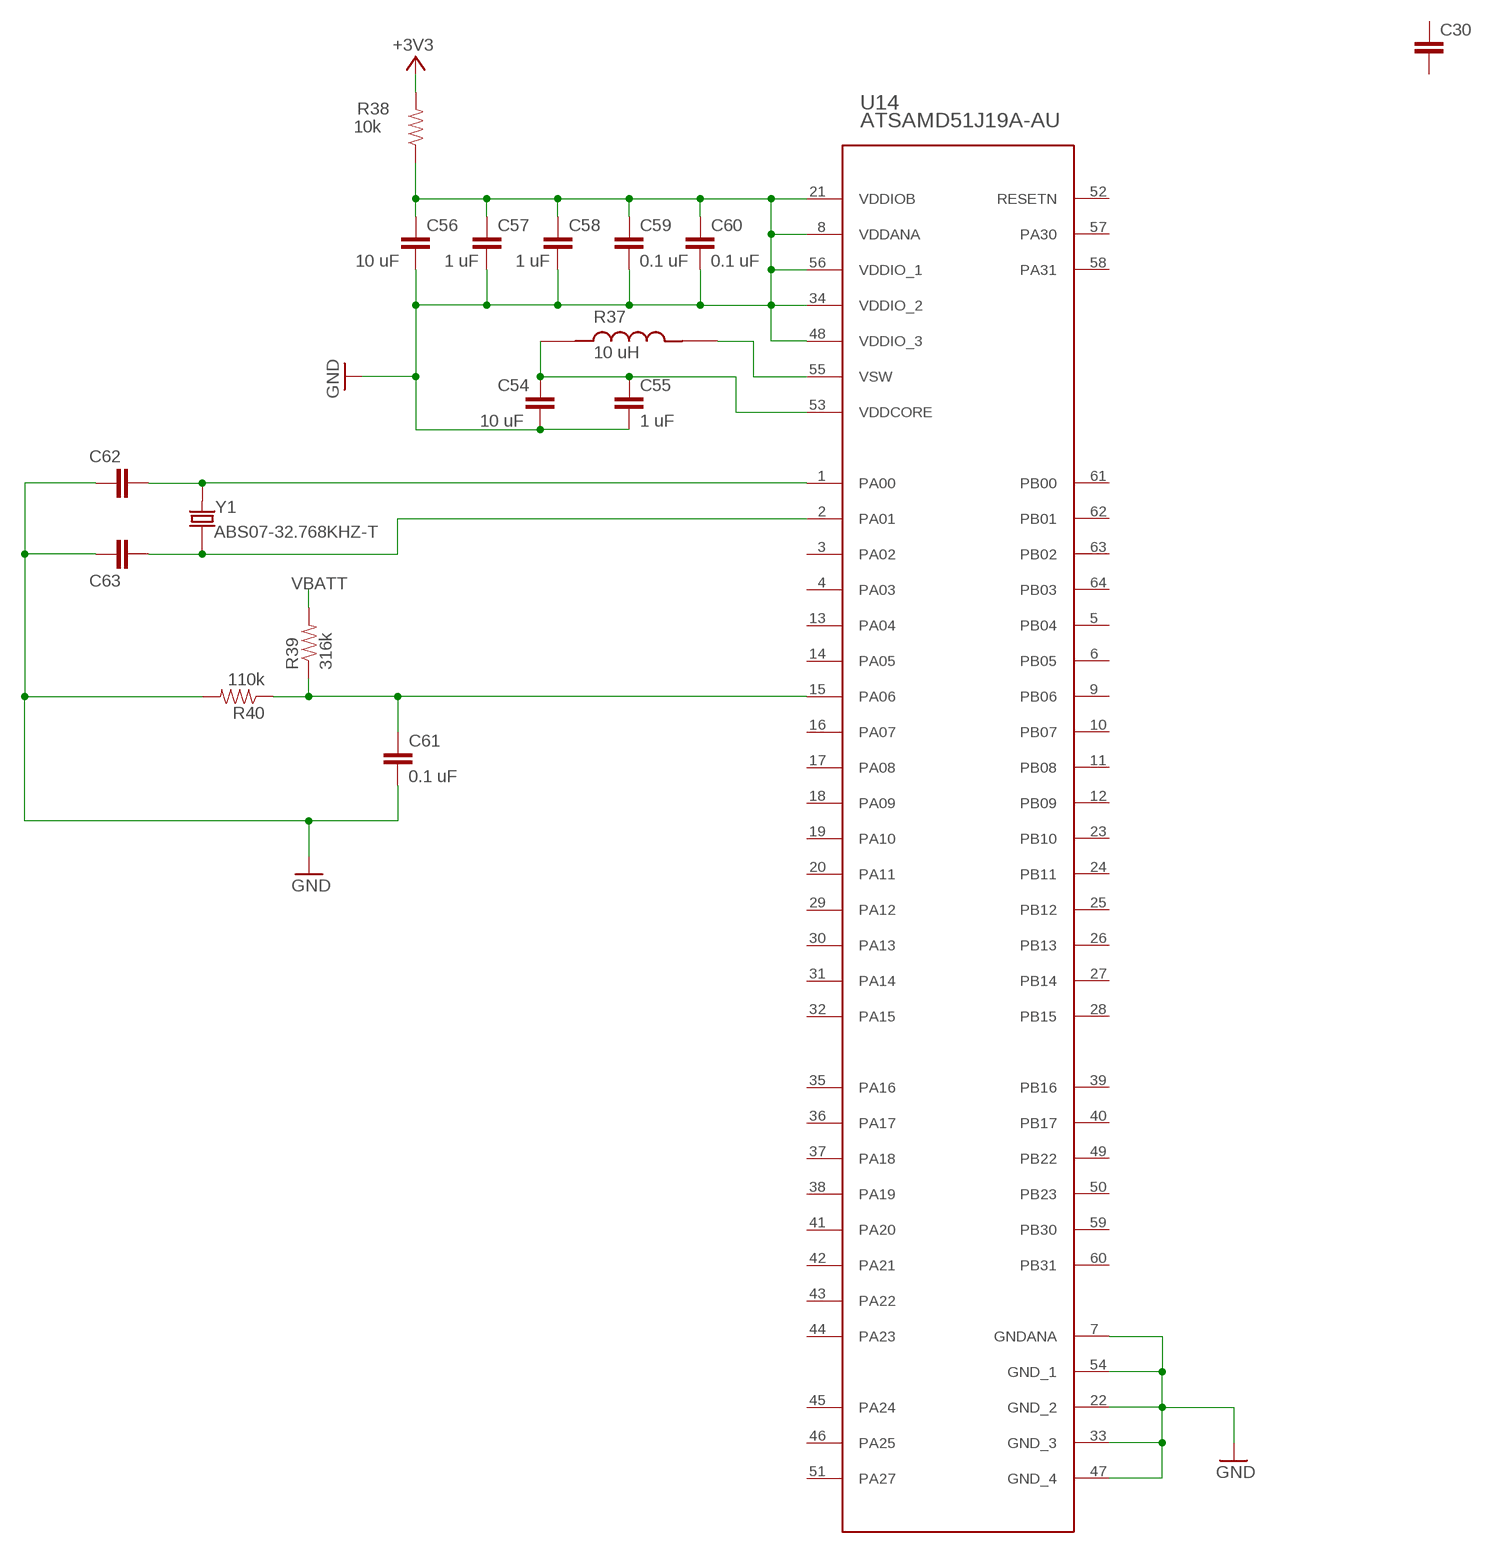
[diagram p8: schematic, sheet 8]

### Parts
C30  CAP0805  [0805]
C54  10 uF  CAP0805  [0805]
C55  1 uF  CAP0805  [0805]
C56  10 uF  CAP0805  [0805]
C57  1 uF  CAP0805  [0805]
C58  1 uF  CAP0805  [0805]
C59  0.1 uF  CAP0805  [0805]
C60  0.1 uF  CAP0805  [0805]
C61  0.1 uF  CAP0805  [0805]
C62  CAP0805  [0805]
C63  CAP0805  [0805]
R37  10 uH  L_0805  [RESC0805X60N]
R38  10k  RESISTOR0805-RES  [0805]
R39  316k  RESISTOR0805-RES  [0805]
R40  110k  RESISTOR0805-RES  [0805]
U14  ATSAMD51J19A-AU  [TQFP64_PT_MCH]
Y1  ABS07-32.768KHZ-T  [XTAL_ABS07-32.768KHZ-T]

### Nets
+3V3: R38.2
GND: C54.2 C55.2 C56.1 C56.2 C57.1 C57.2 C58.1 C58.2 C59.1 C59.2 C60.1 C60.2 C61.2 C62.1 C63.1 R38.1 R40.2 U14.7(GNDANA) U14.8(VDDANA) U14.21(VDDIOB) U14.22(GND_2) U14.33(GND_3) U14.34(VDDIO_2) U14.47(GND_4) U14.48(VDDIO_3) U14.54(GND_1) U14.56(VDDIO_1) ; also sheet 2,3,4,5,6,7,9
N$46: R37.2 U14.55(VSW)
N$54: C61.1 R39.1 R40.1 U14.15(PA06)
N$58: C54.1 C55.1 R37.1 U14.53(VDDCORE)
N$60: C62.2 U14.1(PA00) Y1.2
N$62: C63.2 U14.2(PA01) Y1.1
VBATT: R39.2 ; also sheet 7
Unconnected: C30.1 C30.2 U14.3(PA02) U14.4(PA03) U14.5(PB04) U14.6(PB05) U14.9(PB06) U14.10(PB07) U14.11(PB08) U14.12(PB09) U14.13(PA04) U14.14(PA05) U14.16(PA07) U14.17(PA08) U14.18(PA09) U14.19(PA10) U14.20(PA11) U14.23(PB10) U14.24(PB11) U14.25(PB12) U14.26(PB13) U14.27(PB14) U14.28(PB15) U14.29(PA12) U14.30(PA13) U14.31(PA14) U14.32(PA15) U14.35(PA16) U14.36(PA17) U14.37(PA18) U14.38(PA19) U14.39(PB16) U14.40(PB17) U14.41(PA20) U14.42(PA21) U14.43(PA22) U14.44(PA23) U14.45(PA24) U14.46(PA25) U14.49(PB22) U14.50(PB23) U14.51(PA27) U14.52(RESETN) U14.57(PA30) U14.58(PA31) U14.59(PB30) U14.60(PB31) U14.61(PB00) U14.62(PB01) U14.63(PB02) U14.64(PB03)

## Sheet 9 of 10: Current Sensors
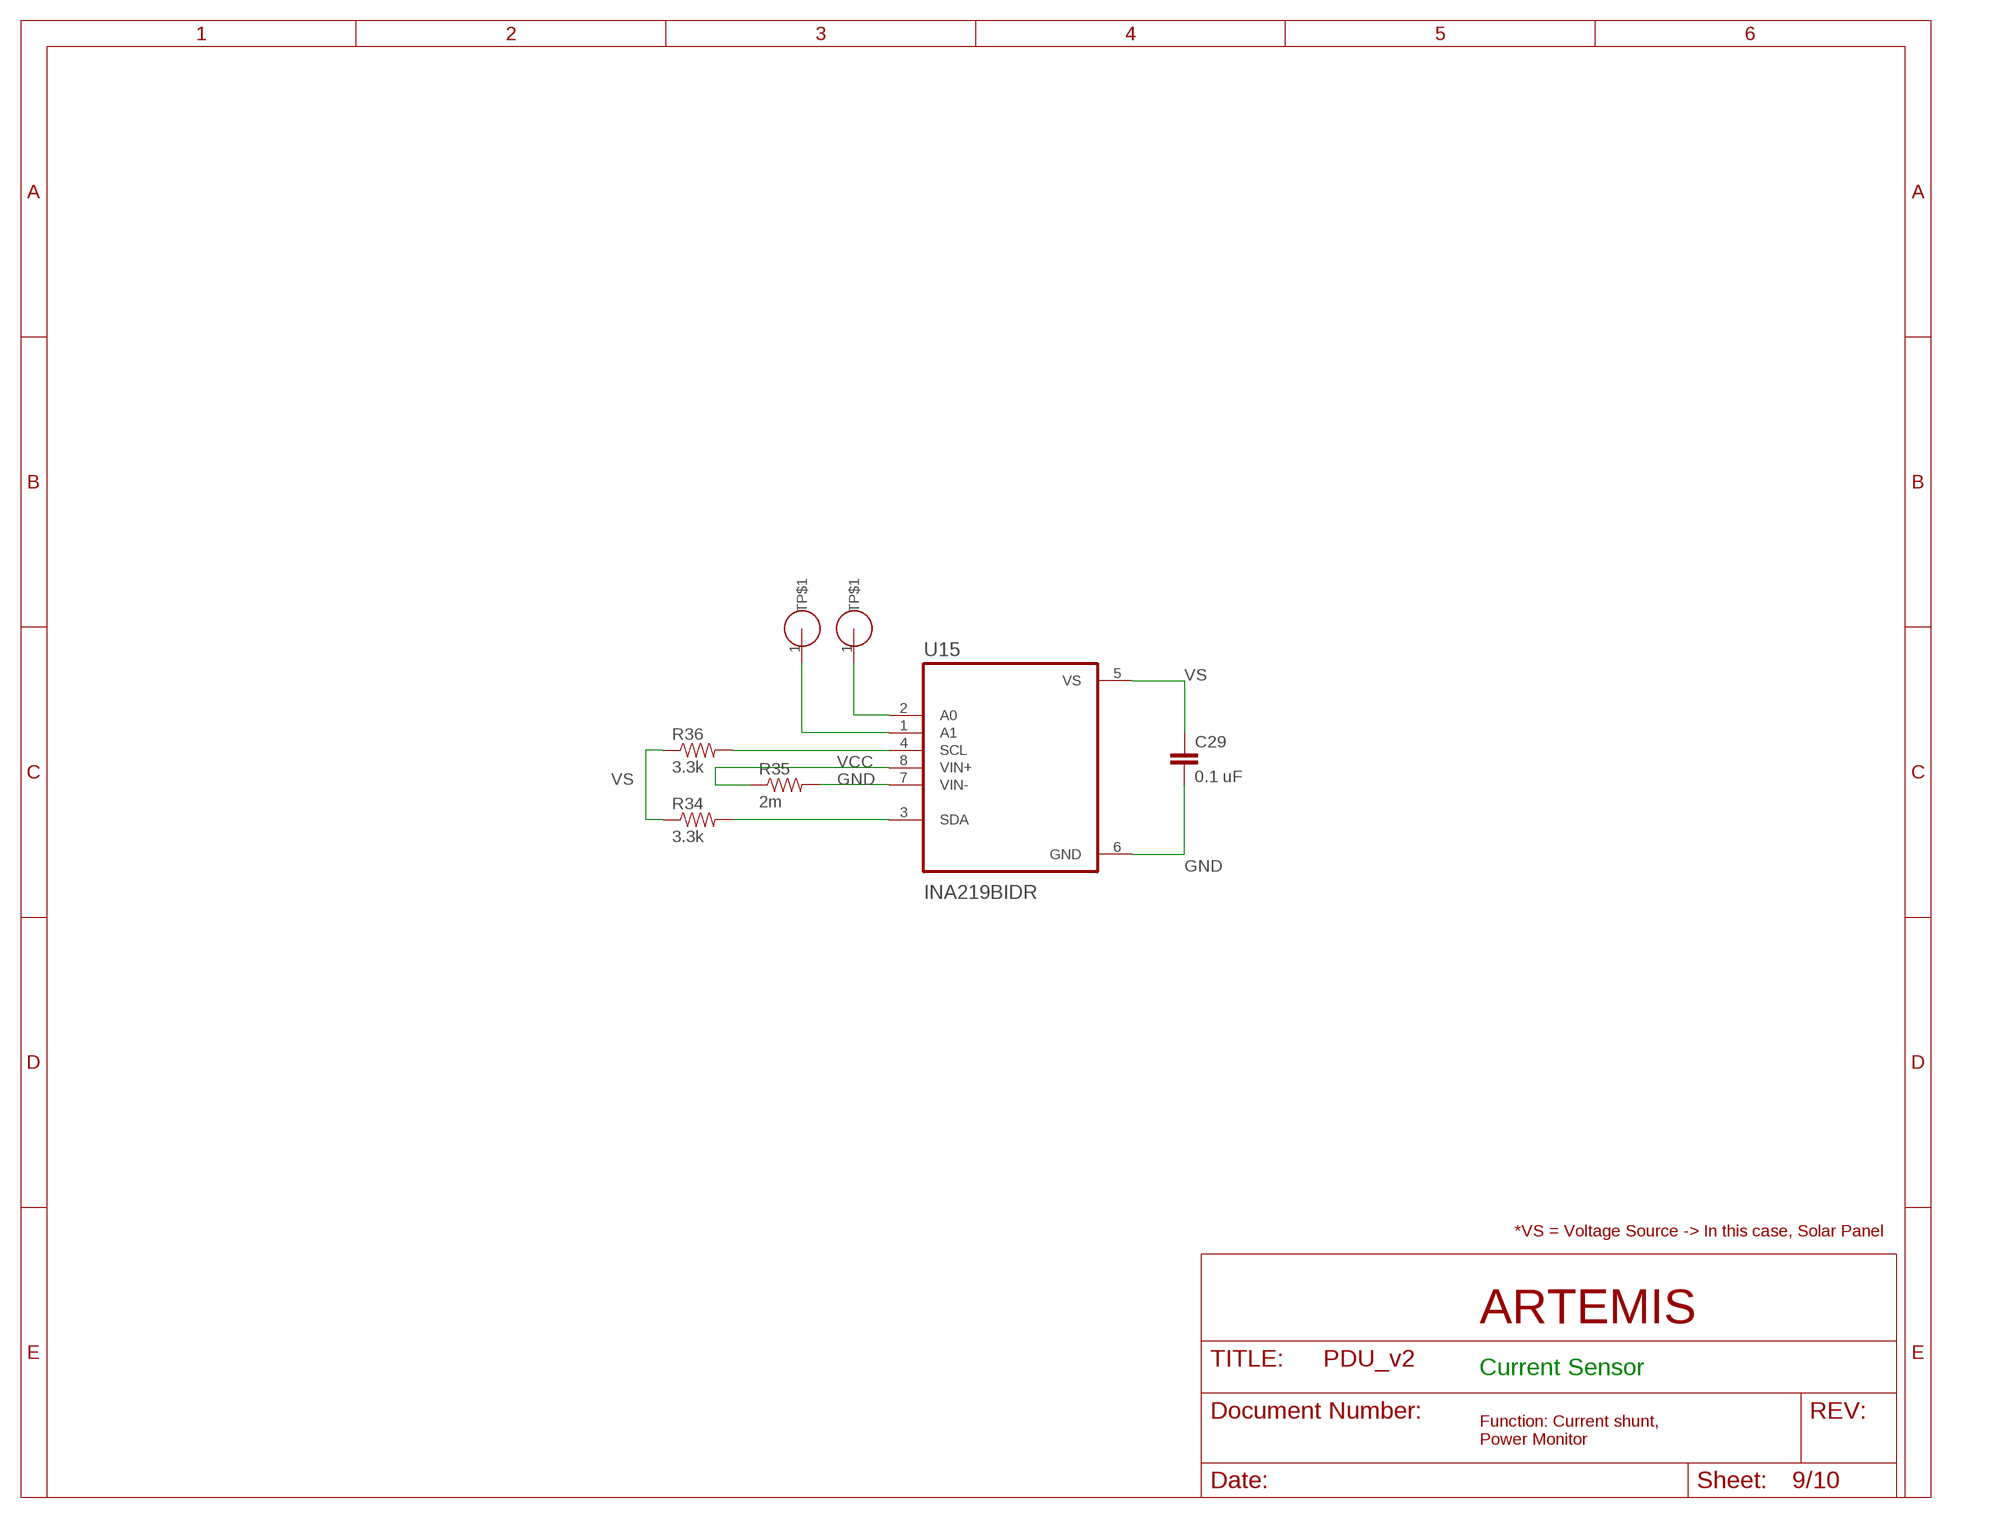
[diagram p9: schematic, sheet 9]

### Parts
C29  0.1 uF  CAP0805  [0805]
R34  3.3k  RESISTOR0805-RES  [0805]
R35  2m  RESISTOR0805-RES  [0805]
R36  3.3k  RESISTOR0603-RES  [0603-RES]
U15  INA219BIDR  [SOIC127P599X175-8N]
U$2  TEST_POINT  [TEST_POINT]
U$4  TEST_POINT  [TEST_POINT]

### Nets
GND: C29.2 R35.2 U15.6(GND) U15.7(VIN-) ; also sheet 2,3,4,5,6,7,8
N$56: U15.2(A0) U$2.1(TP$1)
N$57: U15.1(A1) U$4.1(TP$1)
N$59: R34.2 U15.3(SDA)
N$61: R36.2 U15.4(SCL)
VCC: R35.1 U15.8(VIN+) ; also sheet 5
VS: C29.1 R34.1 R36.1 U15.5(VS)

### Notes on the sheet
- *VS = Voltage Source -> In this case, Solar Panel
- ARTEMIS
- Current Sensor
- Function: Current shunt, 
  Power Monitor

## Sheet 10 of 10: Solar Charging
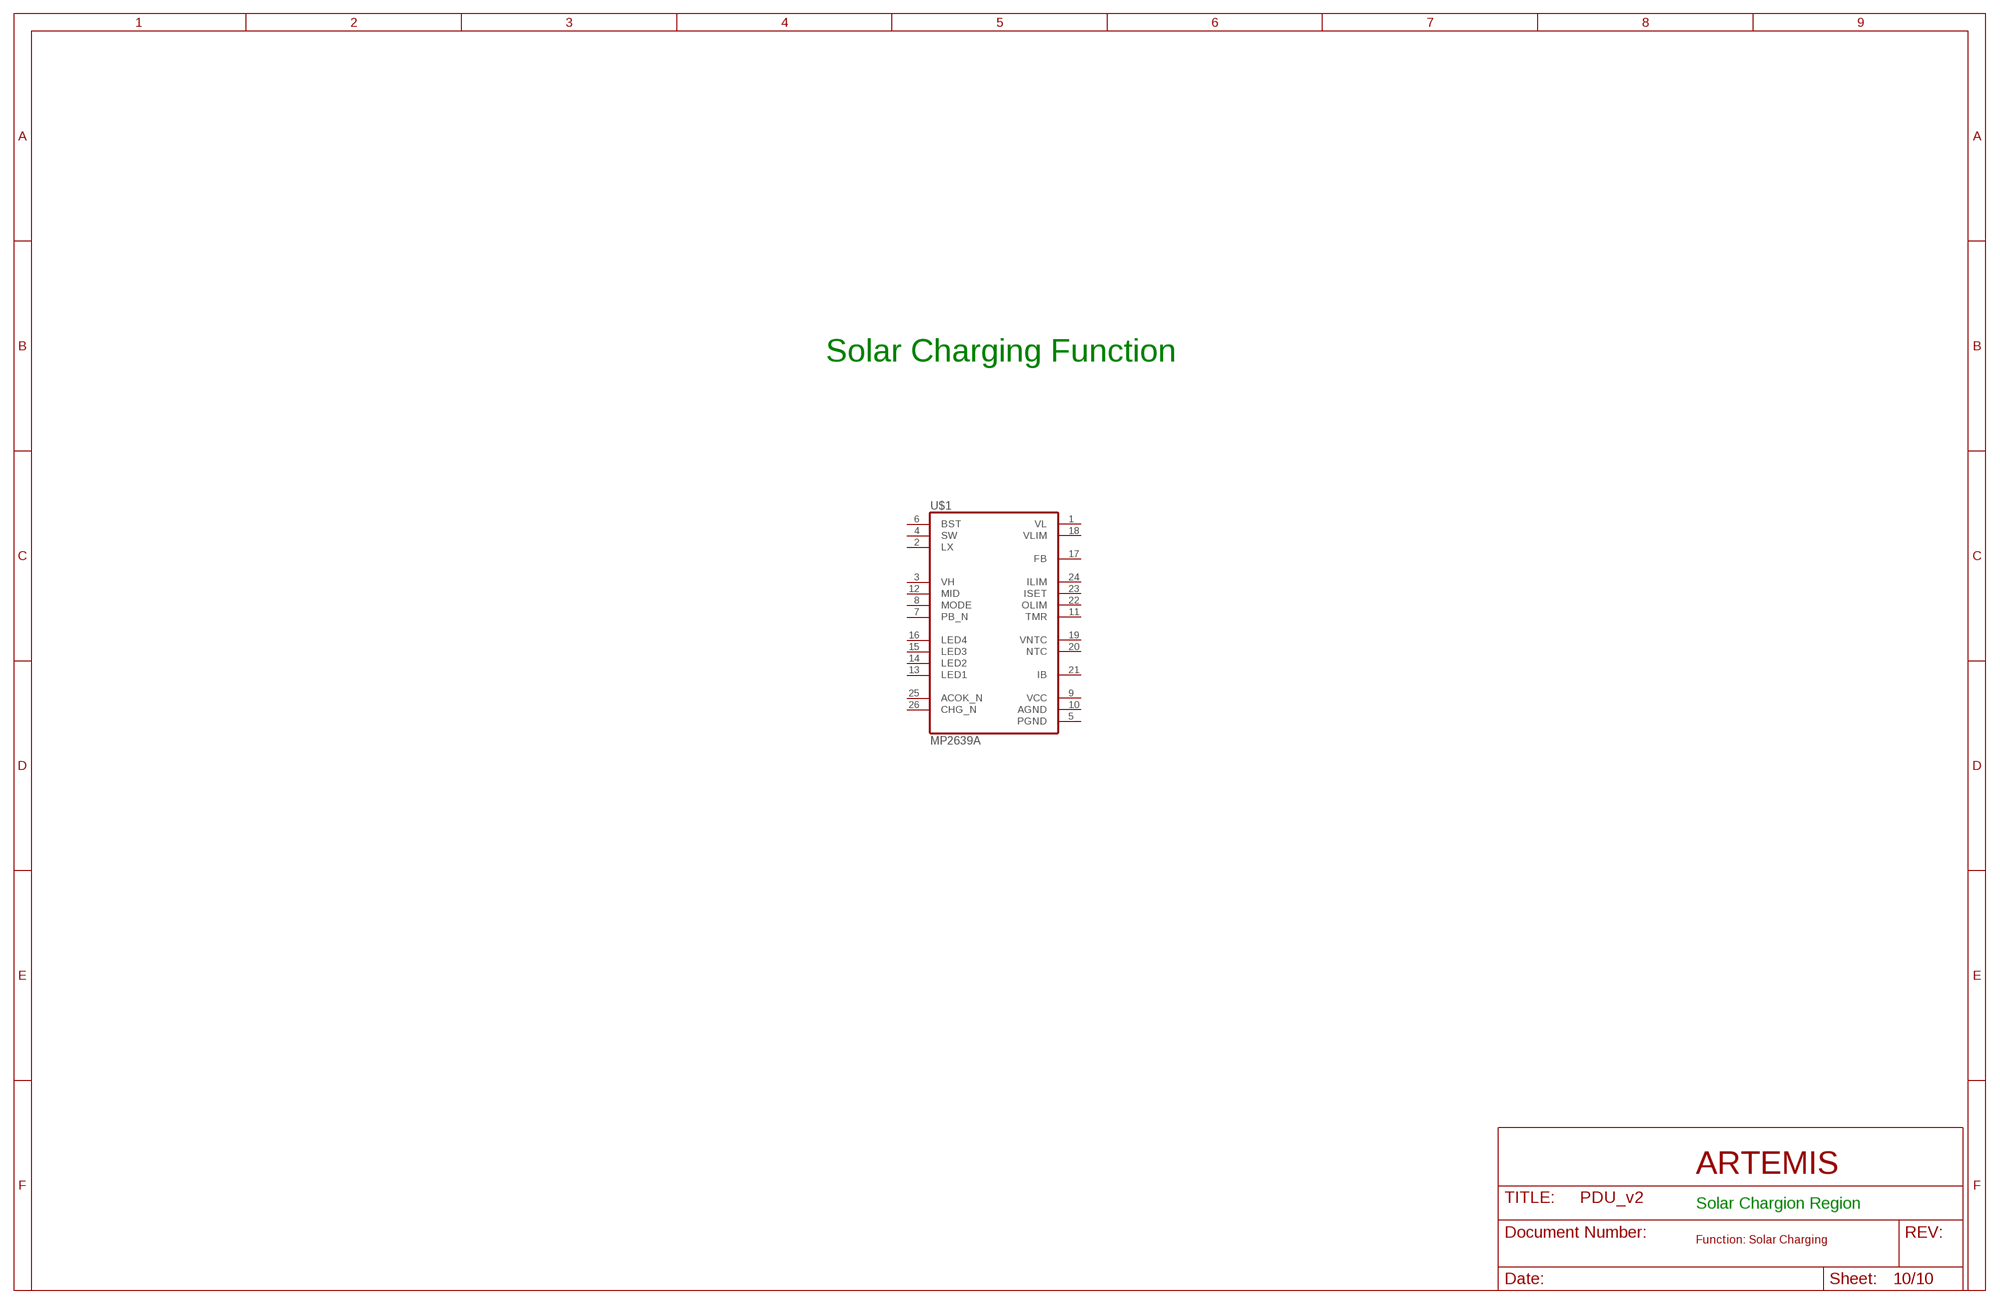
[diagram p10: schematic, sheet 10]

### Parts
U$1  MP2639A  [QFN26-4X4_MP2639A]
Unconnected: U$1.7(PB_N) U$1.8(MODE) U$1.11(TMR) U$1.12(MID) U$1.13(LED1) U$1.14(LED2) U$1.15(LED3) U$1.16(LED4) U$1.17(FB) U$1.18(VLIM) U$1.19(VNTC) U$1.20(NTC) U$1.21(IB) U$1.22(OLIM) U$1.23(ISET) U$1.24(ILIM) U$1.25(ACOK_N) U$1.26(CHG_N)

### Notes on the sheet
- Solar Charging Function
- ARTEMIS
- Solar Chargion Region
- Function: Solar Charging

## Power pins joined to a net without a drawn wire
AGND: U$1.10(AGND)
BST: U$1.6(BST)
LX: U$1.2(LX)
PGND: U$1.5(PGND)
SW: U$1.4(SW)
VCC: U$1.9(VCC)
VH: U$1.3(VH)
VIN3: U3.6(VIN3) U4.6(VIN3) U5.6(VIN3) U6.6(VIN3) U7.6(VIN3) U8.6(VIN3) U9.6(VIN3)
VL: U$1.1(VL)

## Library data of the parts
C1-C63 C74-C81 = HSFL_Main_Library:CAP: Capacitor Standard 0603 ceramic capacitor, and 0.1" leaded capacitor.
D1 = Artemis:SBR2A40P1Q7: Schottky Diode; MF: Diodes Inc; MOUSER: 621-DFLS130L; MPN: DFLS130L-7
D4 = adafruit:DIODE: Diode SMADIODE - SMA Surface Mount Package 20V 1A Schottky Diode Digikey: 641-1014-6-ND DO-1N4148 - Through Hole Small Current Diode SOD-123 20V 1 A (.5mV Vf) Schottky Diode - Digikey: MBRX120TPMSCT-ND SOD-323 10V 570mA (.38mV Vf, 3ns) Schottky Diode - Digikey: ZLLS410CT-ND SOD-523 30V 30mA Schottky Diode (RB751S-40TE61) - Digikey: RB751S-40TE61CT-ND SOT23-R/W - SOT23 Package (R = Solder Paste/Reflow Ovens, W = Hand-Soldering) BAT54Film 40V 300mA - Digikey: 497-7162-1-ND
H1 = HSFL_Main_Library:PC104_WCONN
ISTHISTHERIGHTVALUE ISTHISTHERIGHTVALUE1 R1-R36 R38-R40 R46 R47 = HSFL_Main_Library:RESISTOR: Resistor Basic schematic elements and footprints for 0603, 1206, and PTH resistors.
J1-J14 J16-J19 = Artemis:5037630291; BUILT_BY: Molex_Team; COPYRIGHT: Copyright (C) 2018 Accelerated Designs. All rights reserved; MANUFACTURER_PART_NUMBER: 5037630291; SOURCELIBRARY: Add_to_database_2021-03-17; VENDOR: Molex Connector Corporation
J15 = Artemis:5037630491; BUILT_BY: Molex_Team; COPYRIGHT: Copyright (C) 2018 Accelerated Designs. All rights reserved; MANUFACTURER_PART_NUMBER: 5037630491; SOURCELIBRARY: Add_to_database_2021-03-17; VENDOR: Molex Connector Corporation
L1 L3 L4 = Artemis:XFL4020-222ME: Power inductor, shielded, 20% tol, SMT, RoHS, halogen free Check prices <https://pricing.snapeda.com/parts/XFL4020-222ME/Coilcraft/view-part?ref=eda>; AVAILABILITY: No availability data; DESCRIPTION: Power inductor, shielded, 20% tol, SMT, RoHS, halogen free; MF: Coilcraft; MP: XFL4020-222ME; PACKAGE: None; PRICE: None
L5 = HSFL_Main_Library:7443551600
M1-M4 = HSFL_Main_Library:BSZ100N06LS3
R37 = Artemis:L_0805; A_MAX: 0.6; A_MIN: 0.6; A_NOM: 0.6; D_MAX: 2.2; D_MIN: 1.8; D_NOM: 2.0; E_MAX: 1.45; E_MIN: 1.05; E_NOM: 1.25; L1_MAX: 0.5; L1_MIN: 0.2; L1_NOM: 0.3; L_MAX: 0.5; L_MIN: 0.2; L_NOM: 0.3; MANUFACTURER: KOA; STANDARD: IPC 7351B
T1 = Artemis:2N5088: NPN TRANSISTOR
U1 U2 = Artemis:DRV8847PWPR: None Check prices <https://pricing.snapeda.com/parts/DRV8847PWPR/Texas%20Instruments/view-part?ref=eda>; AVAILABILITY: Warning; DESCRIPTION: 18-V, 2-A dual H-bridge motor driver with current regulation & independent half-bridge control 16-HTSSOP -40 to 125; MF: Texas Instruments; MP: DRV8847PWPR; PACKAGE: HTSSOP-16 Texas Instruments; PRICE: None; PURCHASE-URL: https://pricing.snapeda.com/search/part/DRV8847PWPR/?ref=eda
U3-U9 = Artemis:LTC1477CS8: LT-LTC1477-S8-8; CIIVA_IDS: 1432281; COMPONENT_LINK_1_DESCRIPTION: Manufacturer URL; COMPONENT_LINK_1_URL: http://www.linear.com/; COMPONENT_LINK_3_DESCRIPTION: Package Specification; COMPONENT_LINK_3_URL: http://cds.linear.com/docs/en/packaging/05081610_G_SO8.pdf; DATASHEET: http://cds.linear.com/docs/en/datasheet/lt1477.pdf; FOOTPRINT_VARIANT_NAME_0: Level C; FOOTPRINT_VARIANT_NAME_1: Level B; FOOTPRINT_VARIANT_NAME_2: Level A; IMPORTED: yes; IMPORTED_FROM: vault; IMPORT_TS: 1521843574; MF: Linear Technology; MOUNTING_TECHNOLOGY: Surface Mount; MPN: LTC1477CS8; PACKAGE: S8-8; PACKAGE_DESCRIPTION: 8-Pin Plastic Small Outline (Narrow .150 Inch), Body 4.9 x 3.9 mm, Pitch 1.27 mm; PACKAGE_VERSION: Rev. G, 03/2012; PREFIX: U; RELEASE_DATE: 1377817843; ROHS: No; VAULT_GUID: 635B2D7C-EC07-409E-A57F-666E02CD64AC; VAULT_REVISION: 6B8B57C2-2CB3-4970-A31A-1EB58B636423
U10 = Artemis:PE014006; BUILT_BY: EMA_UL_Team; COPYRIGHT: Copyright (C) 2016 Accelerated Designs. All rights reserved; MANUFACTURER_PART_NUMBER: PE014006; SOURCELIBRARY: Tyco_2012-1-03; VENDOR: TE Connectivity
U11 U12 = Artemis:IRLML2803PBFCT-ND; BUILT_BY: EMA_UL_Team; COPYRIGHT: Copyright (C) 2018 Accelerated Designs. All rights reserved; MANUFACTURER_PART_NUMBER: IRLML2803PBFCT-ND; SOURCELIBRARY: Infineon_2019-12-20; VENDOR: Infineon
U13 = Artemis:LT8390EFE#PBF: DC/DC Cntrlr Single-OUT Step Down/Step Up 630kHz Automotive 28-Pin TSSOP EP Tube Check prices <https://pricing.snapeda.com/parts/LT8390EFE%23PBF/Analog%20Devices/view-part?ref=eda>; AVAILABILITY: No availability data; DESCRIPTION: DC/DC Cntrlr Single-OUT Step Down/Step Up 630kHz Automotive 28-Pin TSSOP EP Tube; MF: Analog Devices; MP: LT8390EFE#PBF; PACKAGE: TSSOP -28 Analog Devices; PRICE: None
U14 = Artemis:ATSAMD51J19A-AU; BUILT_BY: EMA_Cory; COPYRIGHT: Copyright (C) 2018 Accelerated Designs. All rights reserved; DATASHEET: http://ww1.microchip.com/downloads/en/DeviceDoc/SAM_D5xE5x_Family_Data_Sheet_DS60001507F.pdf; MANUFACTURER_PART_NUMBER: ATSAMD51J19A-AU; SOURCELIBRARY: Add_to_database_2020-10-19; VENDOR: Microchip
U15 = Artemis:INA219BIDR: Check prices <https://pricing.snapeda.com/parts/INA219BIDR/Texas%20Instruments/view-part?ref=eda>; AVAILABILITY: In Stock; DESCRIPTION: 26V, 12-bit, i2c output current/voltage/power monitor 8-SOIC -40 to 125; MF: Texas Instruments; MP: INA219BIDR; PACKAGE: SOIC-8 Texas Instruments; PRICE: None; PURCHASE-URL: https://pricing.snapeda.com/search/part/INA219BIDR/?ref=eda
U$1 = Artemis:MP2639A: Check prices <https://pricing.snapeda.com/parts/MP2639A/Monolithic%20Power%20Systems/view-part?ref=eda>; AVAILABILITY: No availability data; DESCRIPTION: Charger IC Lithium Ion/Polymer 26-QFN (4x4); MF: Monolithic Power Systems; MP: MP2639A; PACKAGE: QFN-26 Monolithic Power Systems; PRICE: None
U$2 U$4 = HSFL_Main_Library:TEST_POINT
U$3 U$5 U$22 = Artemis:LT8609A
U$6 U$7 = Artemis:NDS8434: 8-SOIC NMOSFET Check prices <https://pricing.snapeda.com/parts/NDS8434/ON%20Semiconductor/view-part?ref=eda>; AVAILABILITY: In Stock; DESCRIPTION: P-Channel 20V 6.5A (Ta) 2.5W (Ta) Surface Mount 8-SOIC; MF: ON Semiconductor; MP: NDS8434; PACKAGE: SO-8 ON Semiconductor; PRICE: None
Y1 = Artemis:ABS07-32.768KHZ-T: ABS07 Series 32.768 kHz ±20 ppm 12.5 pF -40 to +85 °C SMT Low Profile Crystal; DESCRIPTION: 32.768kHz ±20ppm Crystal 12.5pF 70 kOhms 2-SMD, No Lead; DIGI-KEY_PART_NUMBER: 535-9542-1-ND; MF: Abracon; MP: ABS07-32.768KHZ-T; PACKAGE: SMD-2 Abracon LLC